# EasyEDA Pro project ProDoc_Avaota Pi A_2024-08-17.epro, schematic Avaota Pi A, sheets 6 to 13 of 13

## Sheets
6 PERF1: Board Name: Avaota Pi A; Create Date: 2024-02-07; Page Name: PERF1; Project Name: Avaota A1 八核 AIoT 开发板; Schematic Name: Avaota Pi A; Update Date: 2024-05-12
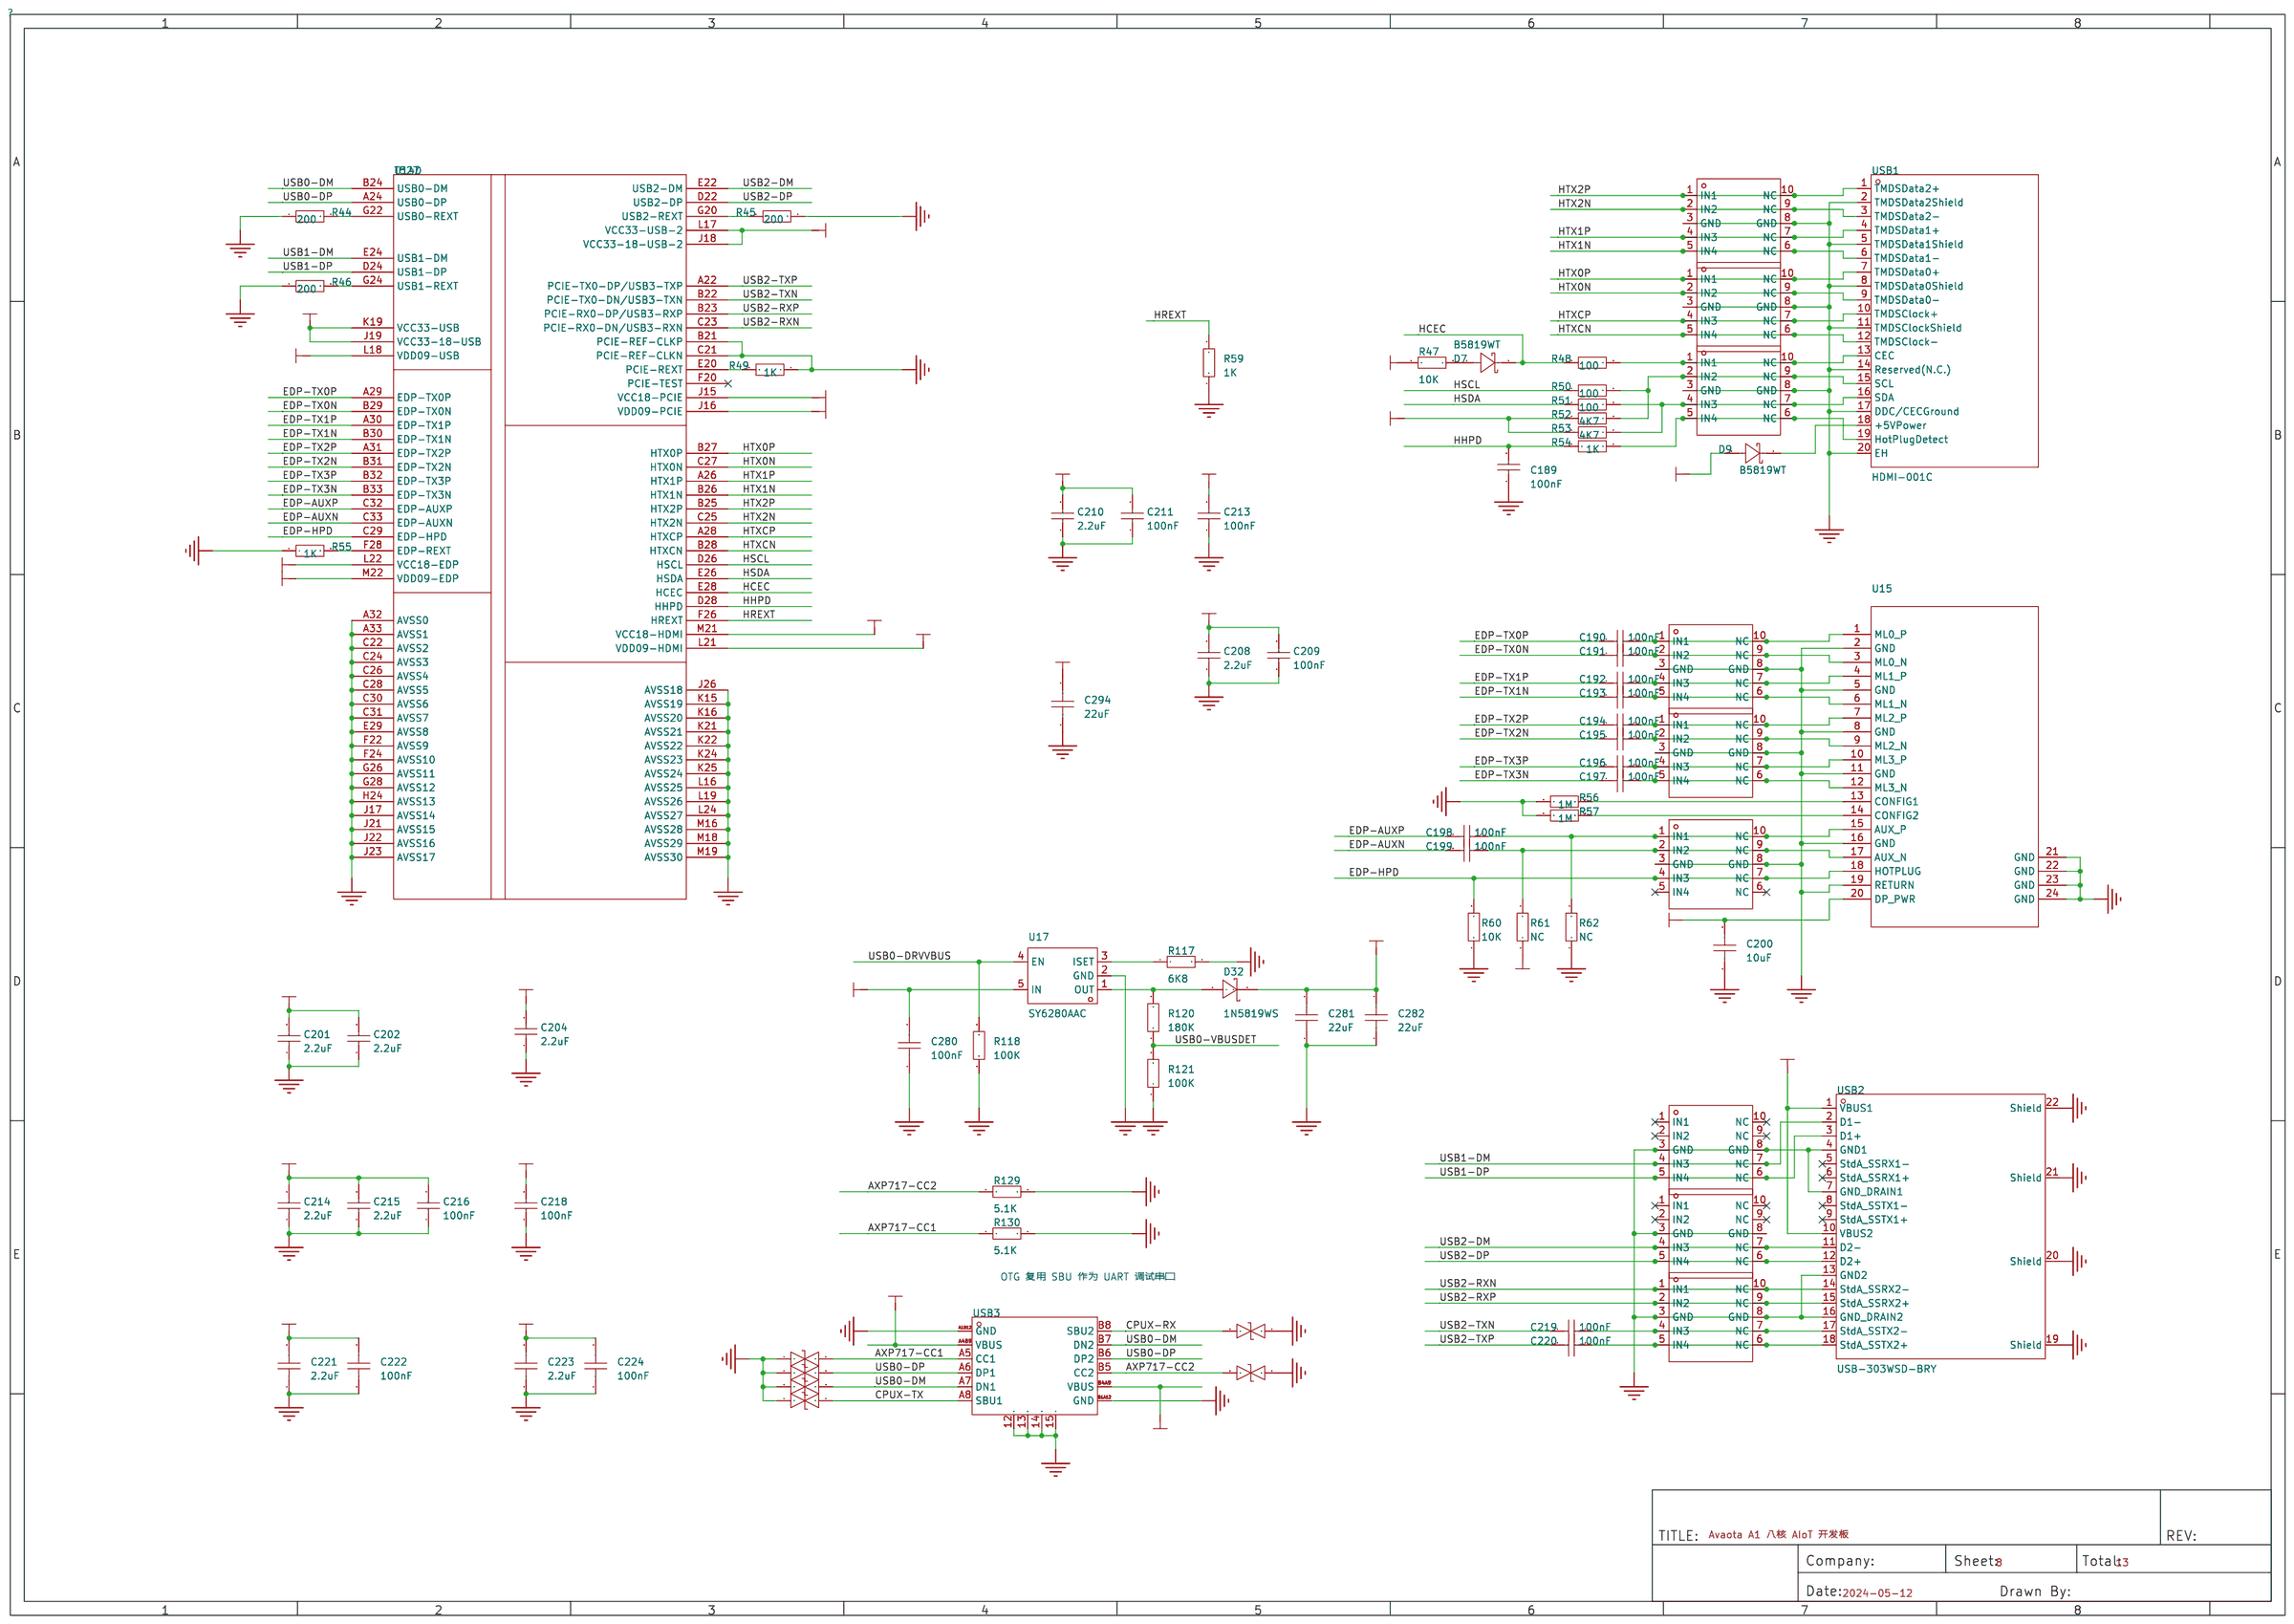
[diagram p5: PERF1]
7 BLOCK
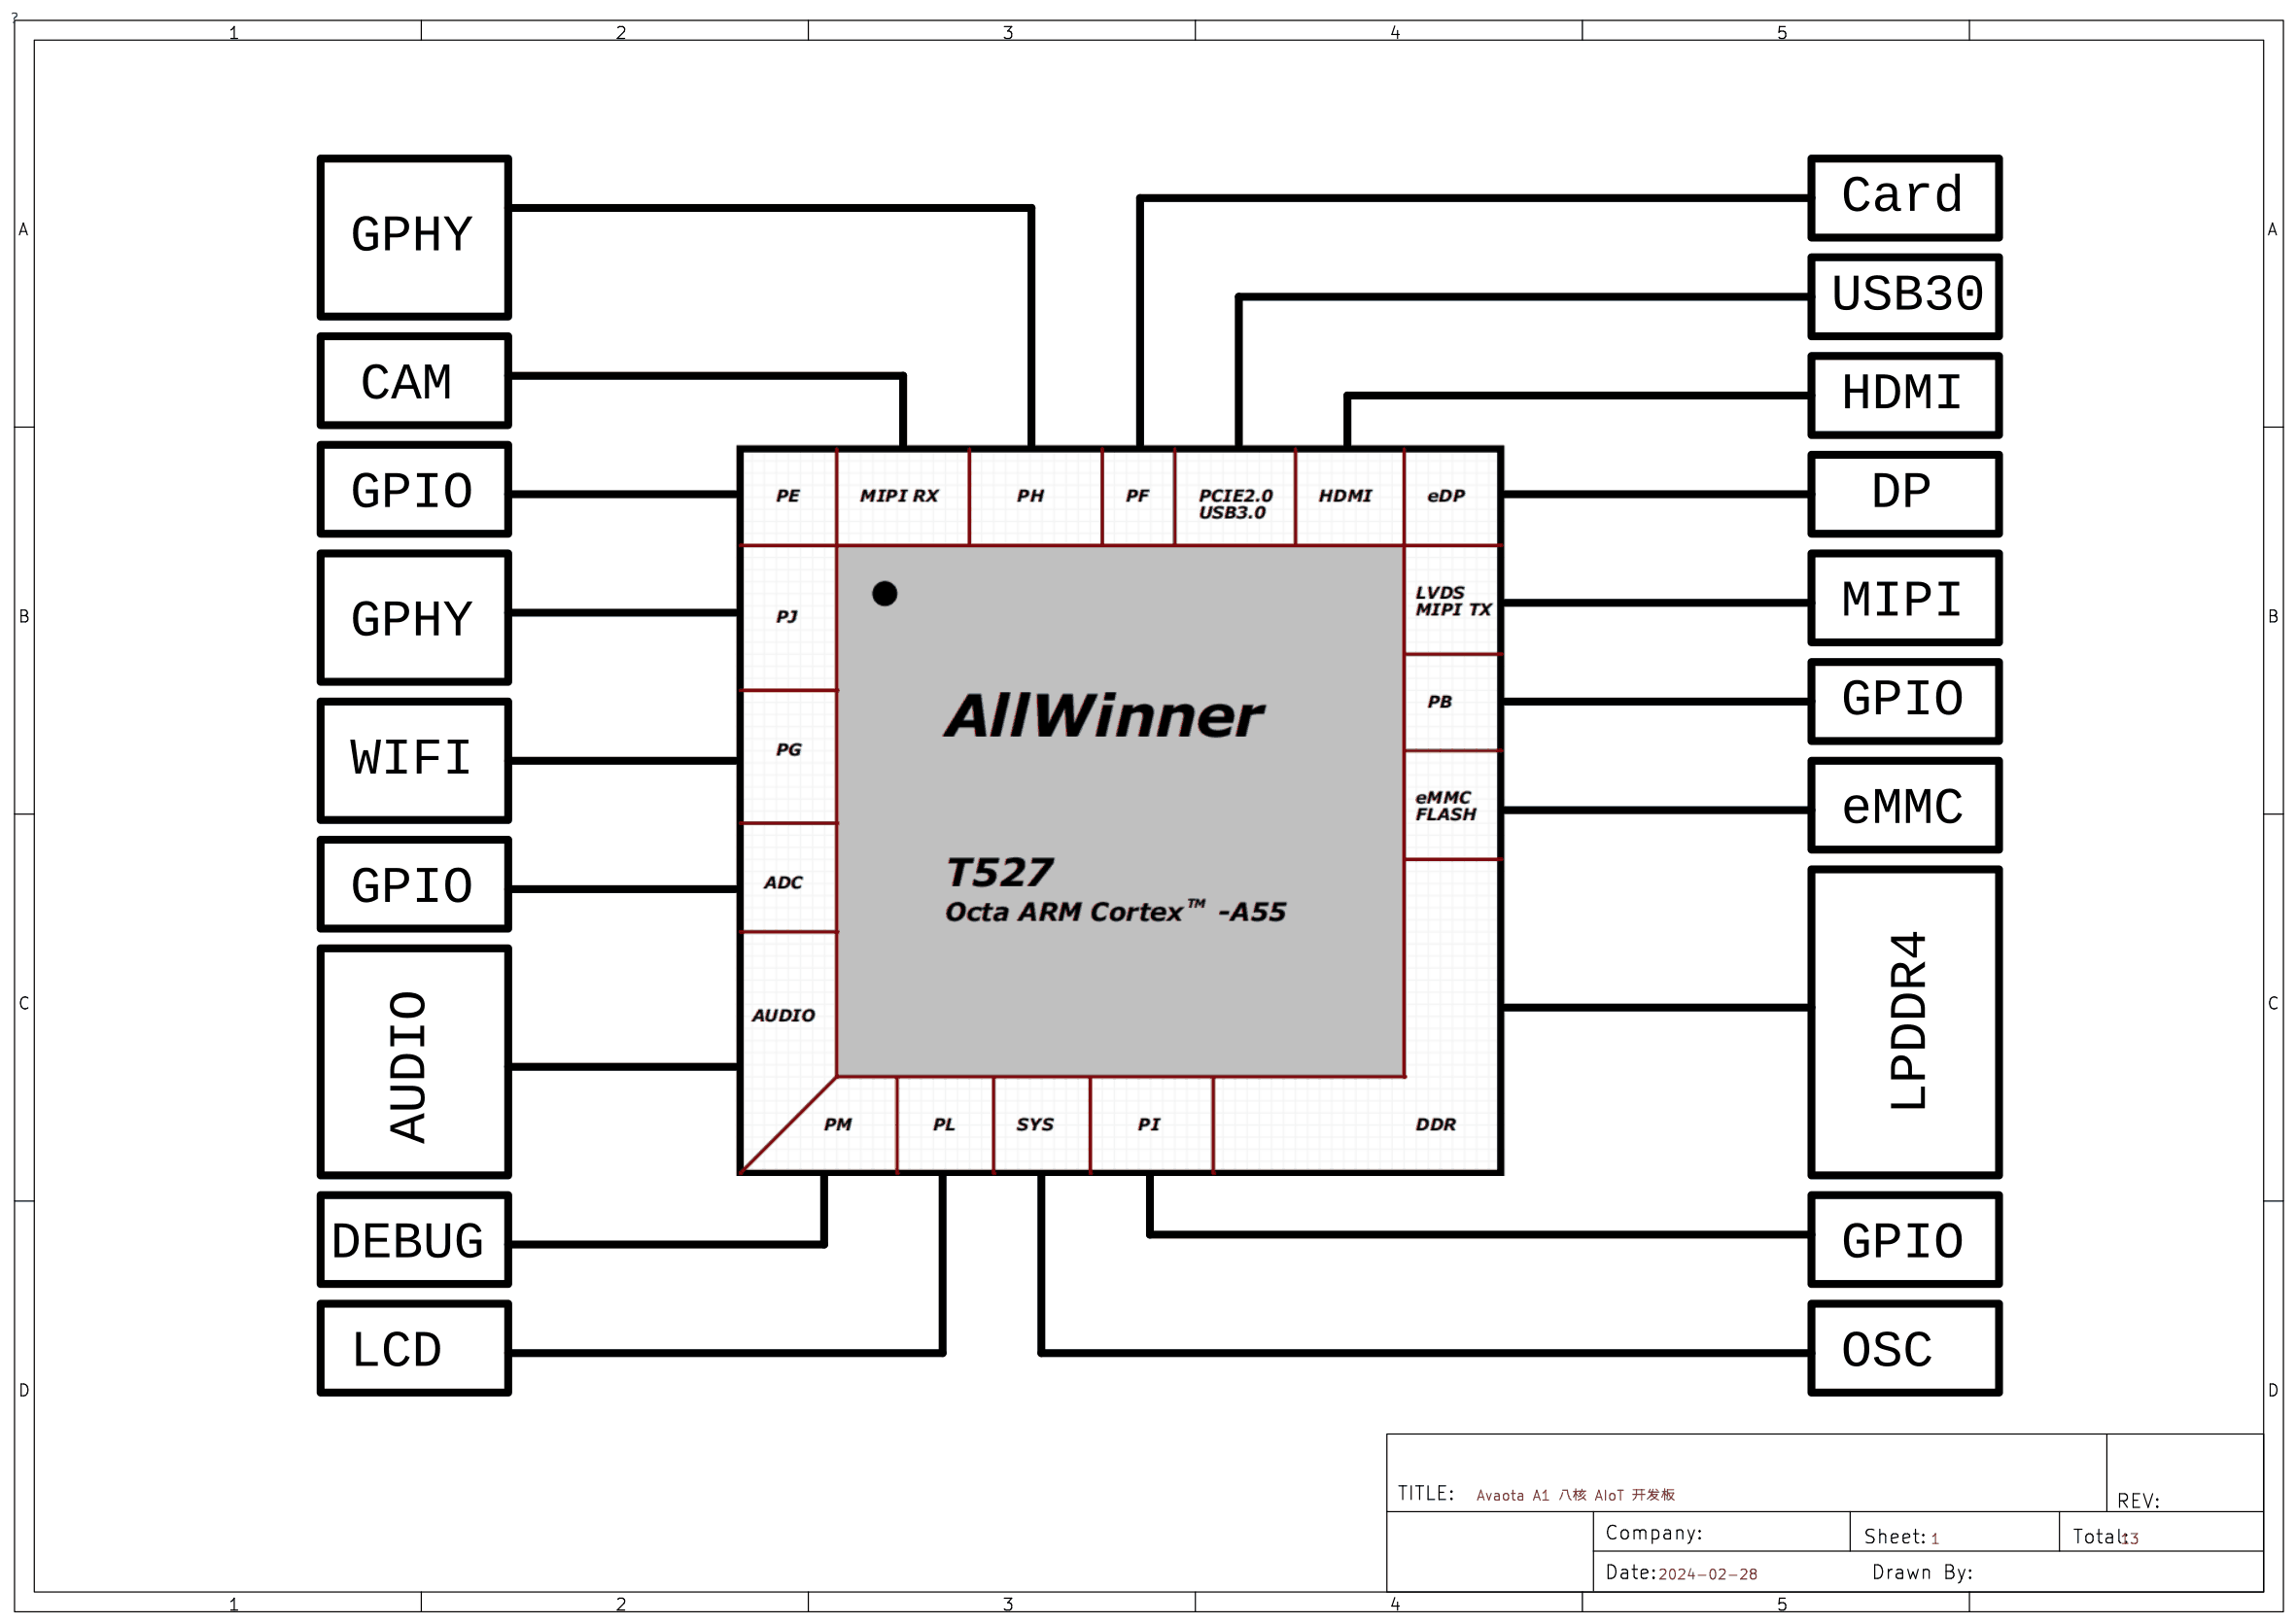
[diagram p6: BLOCK]
8 PERF2
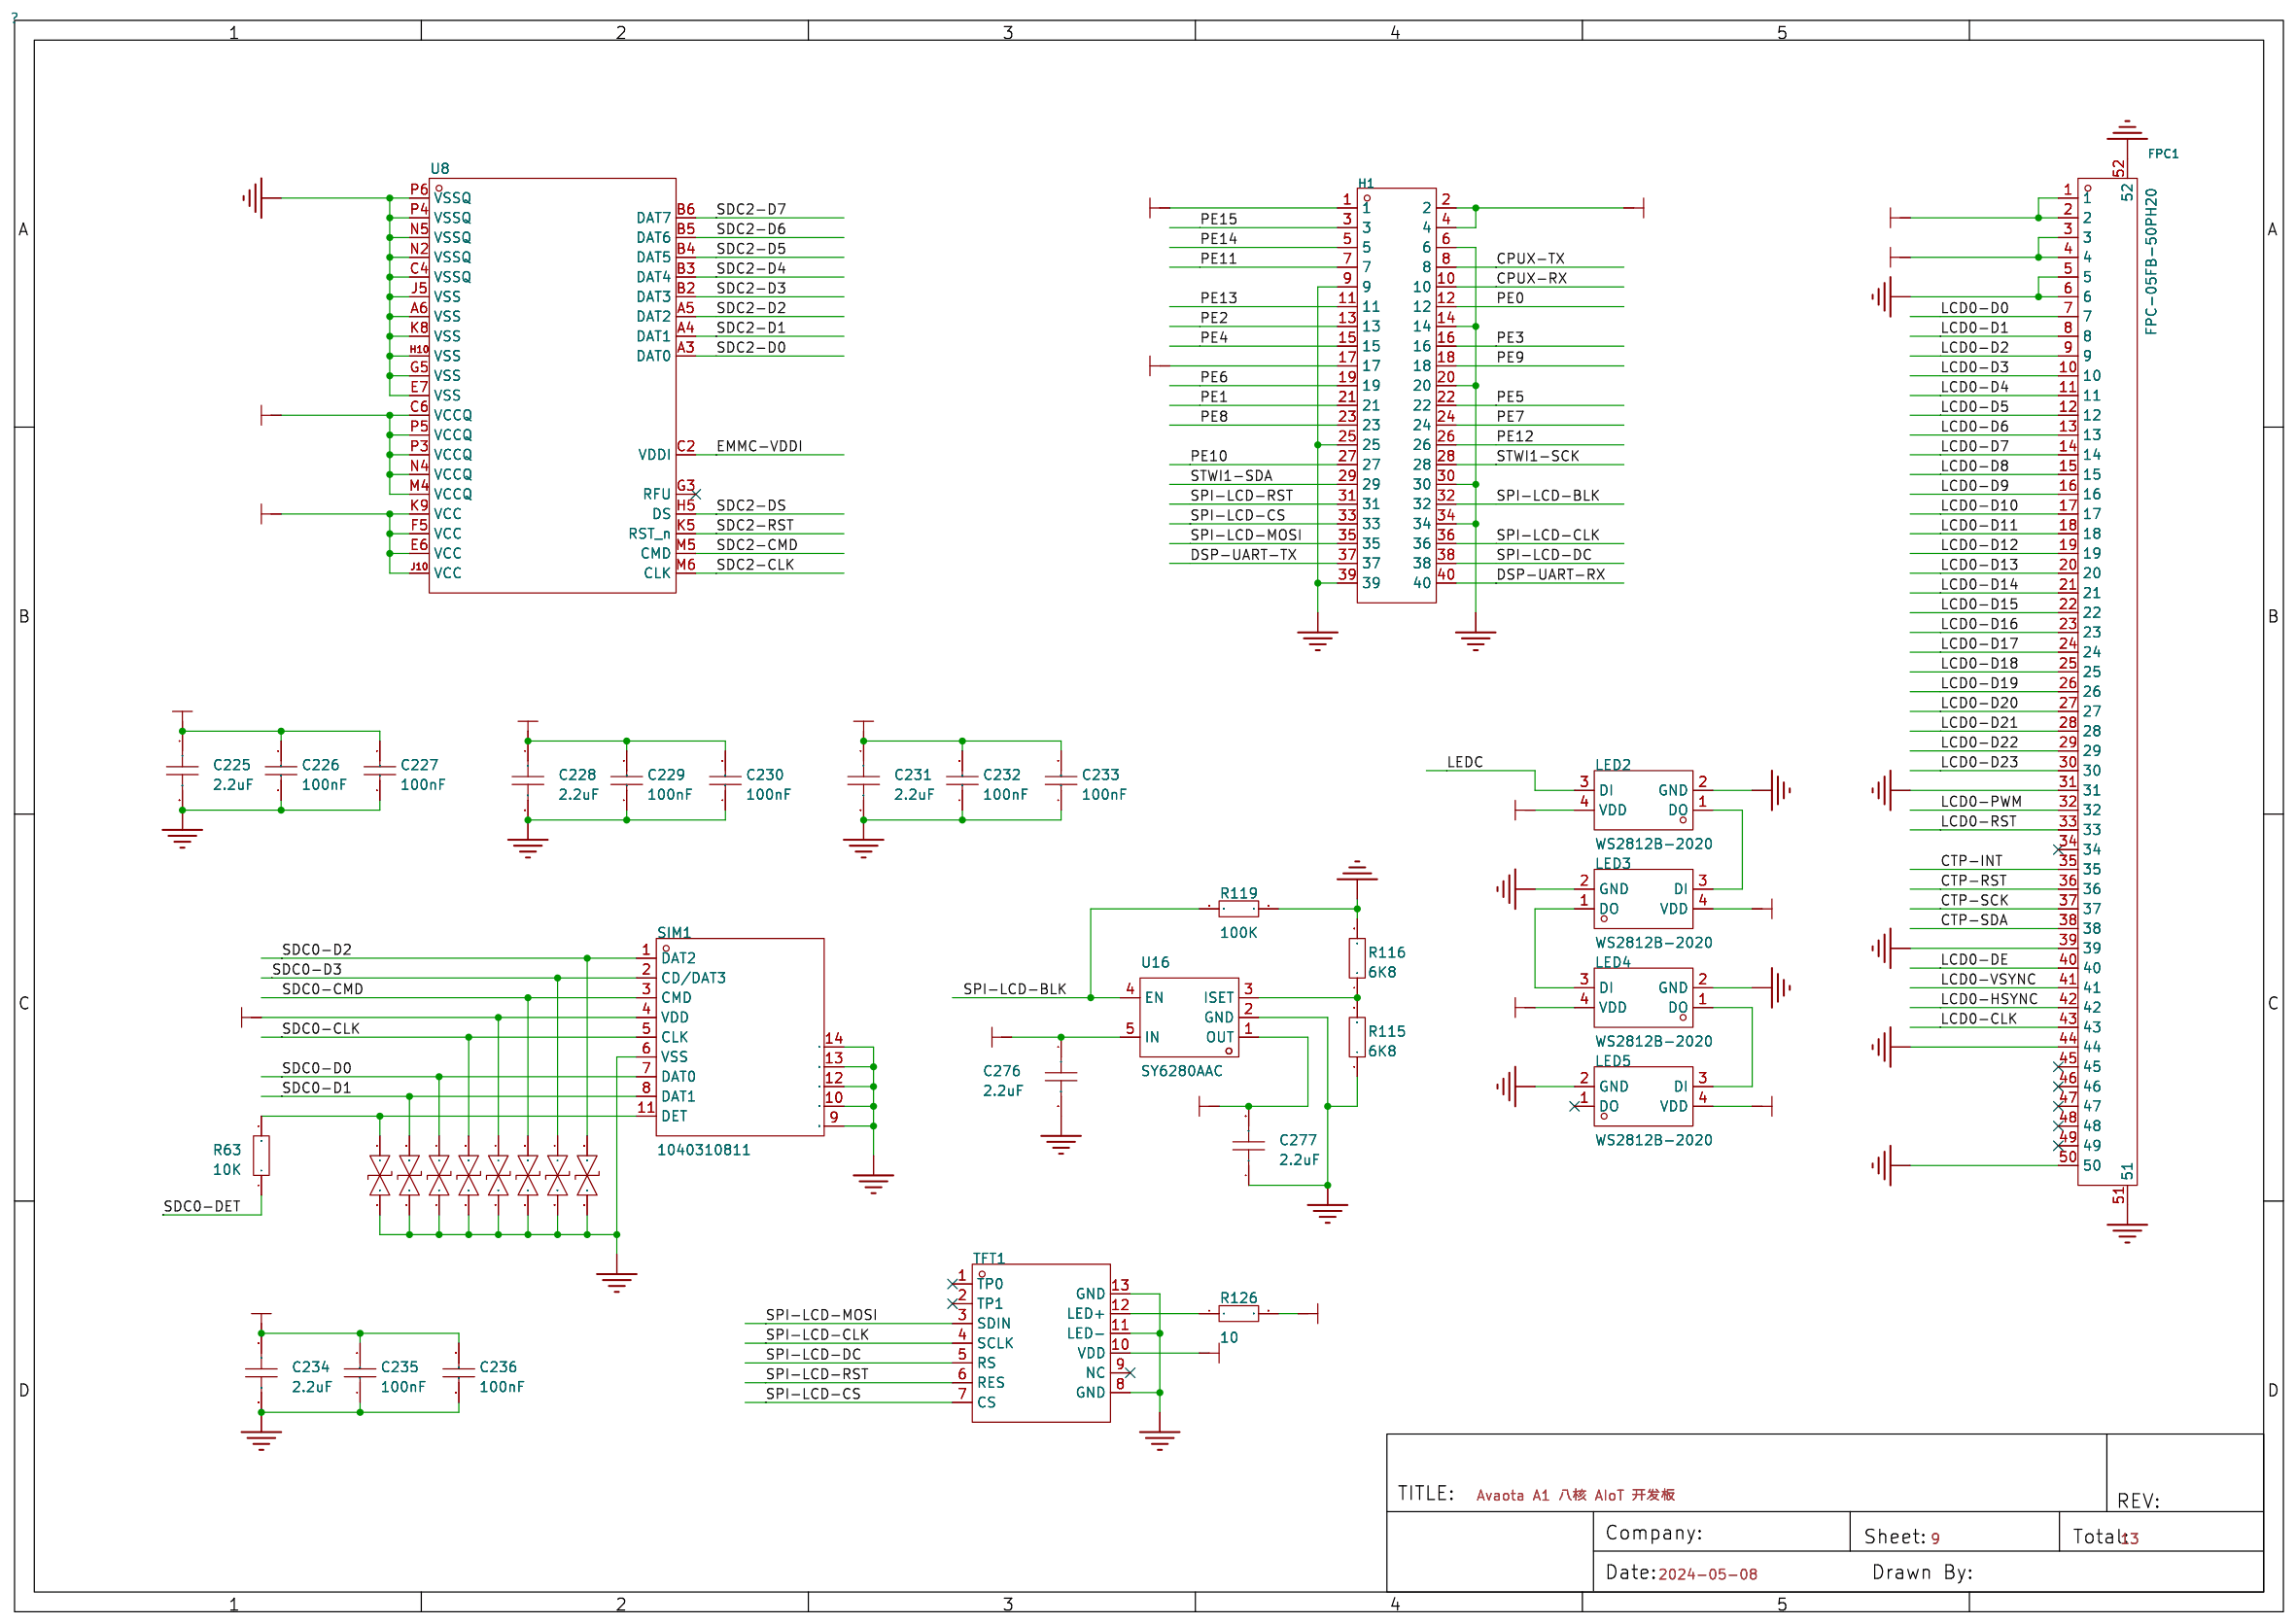
[diagram p7: PERF2]
9 GMAC0: Board Name: Avaota Pi A; Create Date: 2024-02-19; Page Name: GMAC0; Project Name: Avaota A1 八核 AIoT 开发板; Schematic Name: Avaota Pi A; Update Date: 2024-04-03
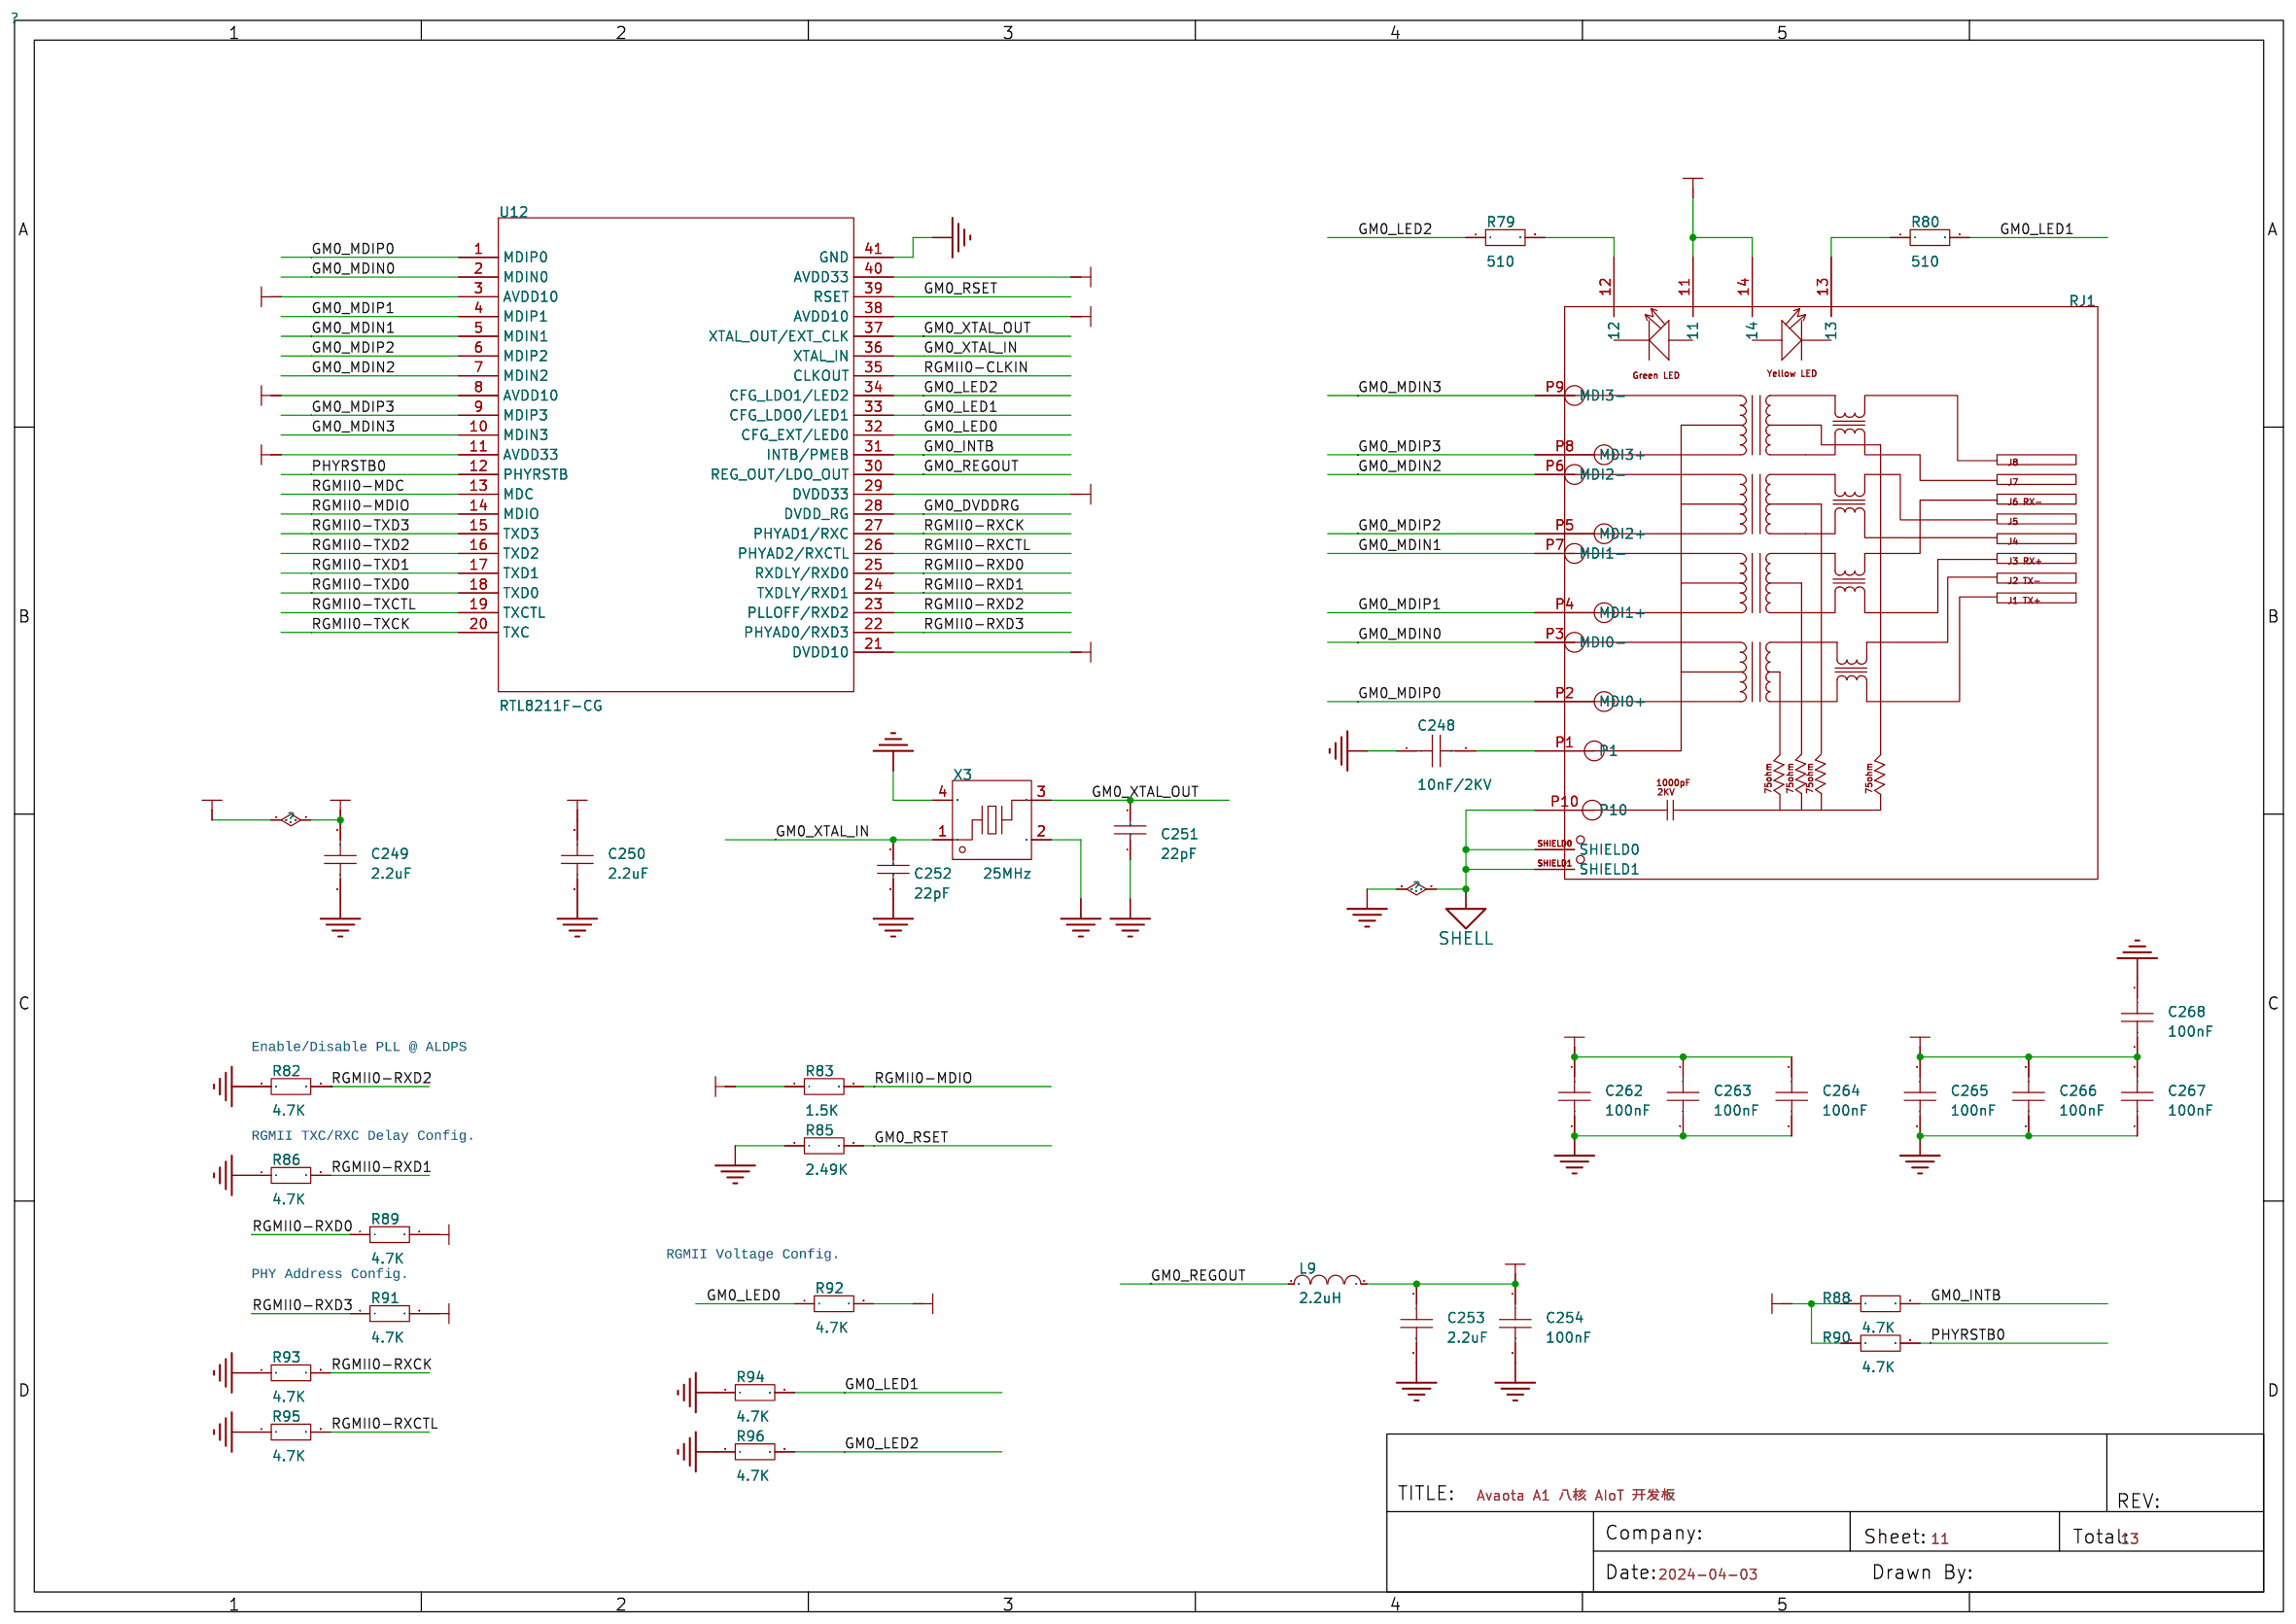
[diagram p8: GMAC0]
10 GMAC1
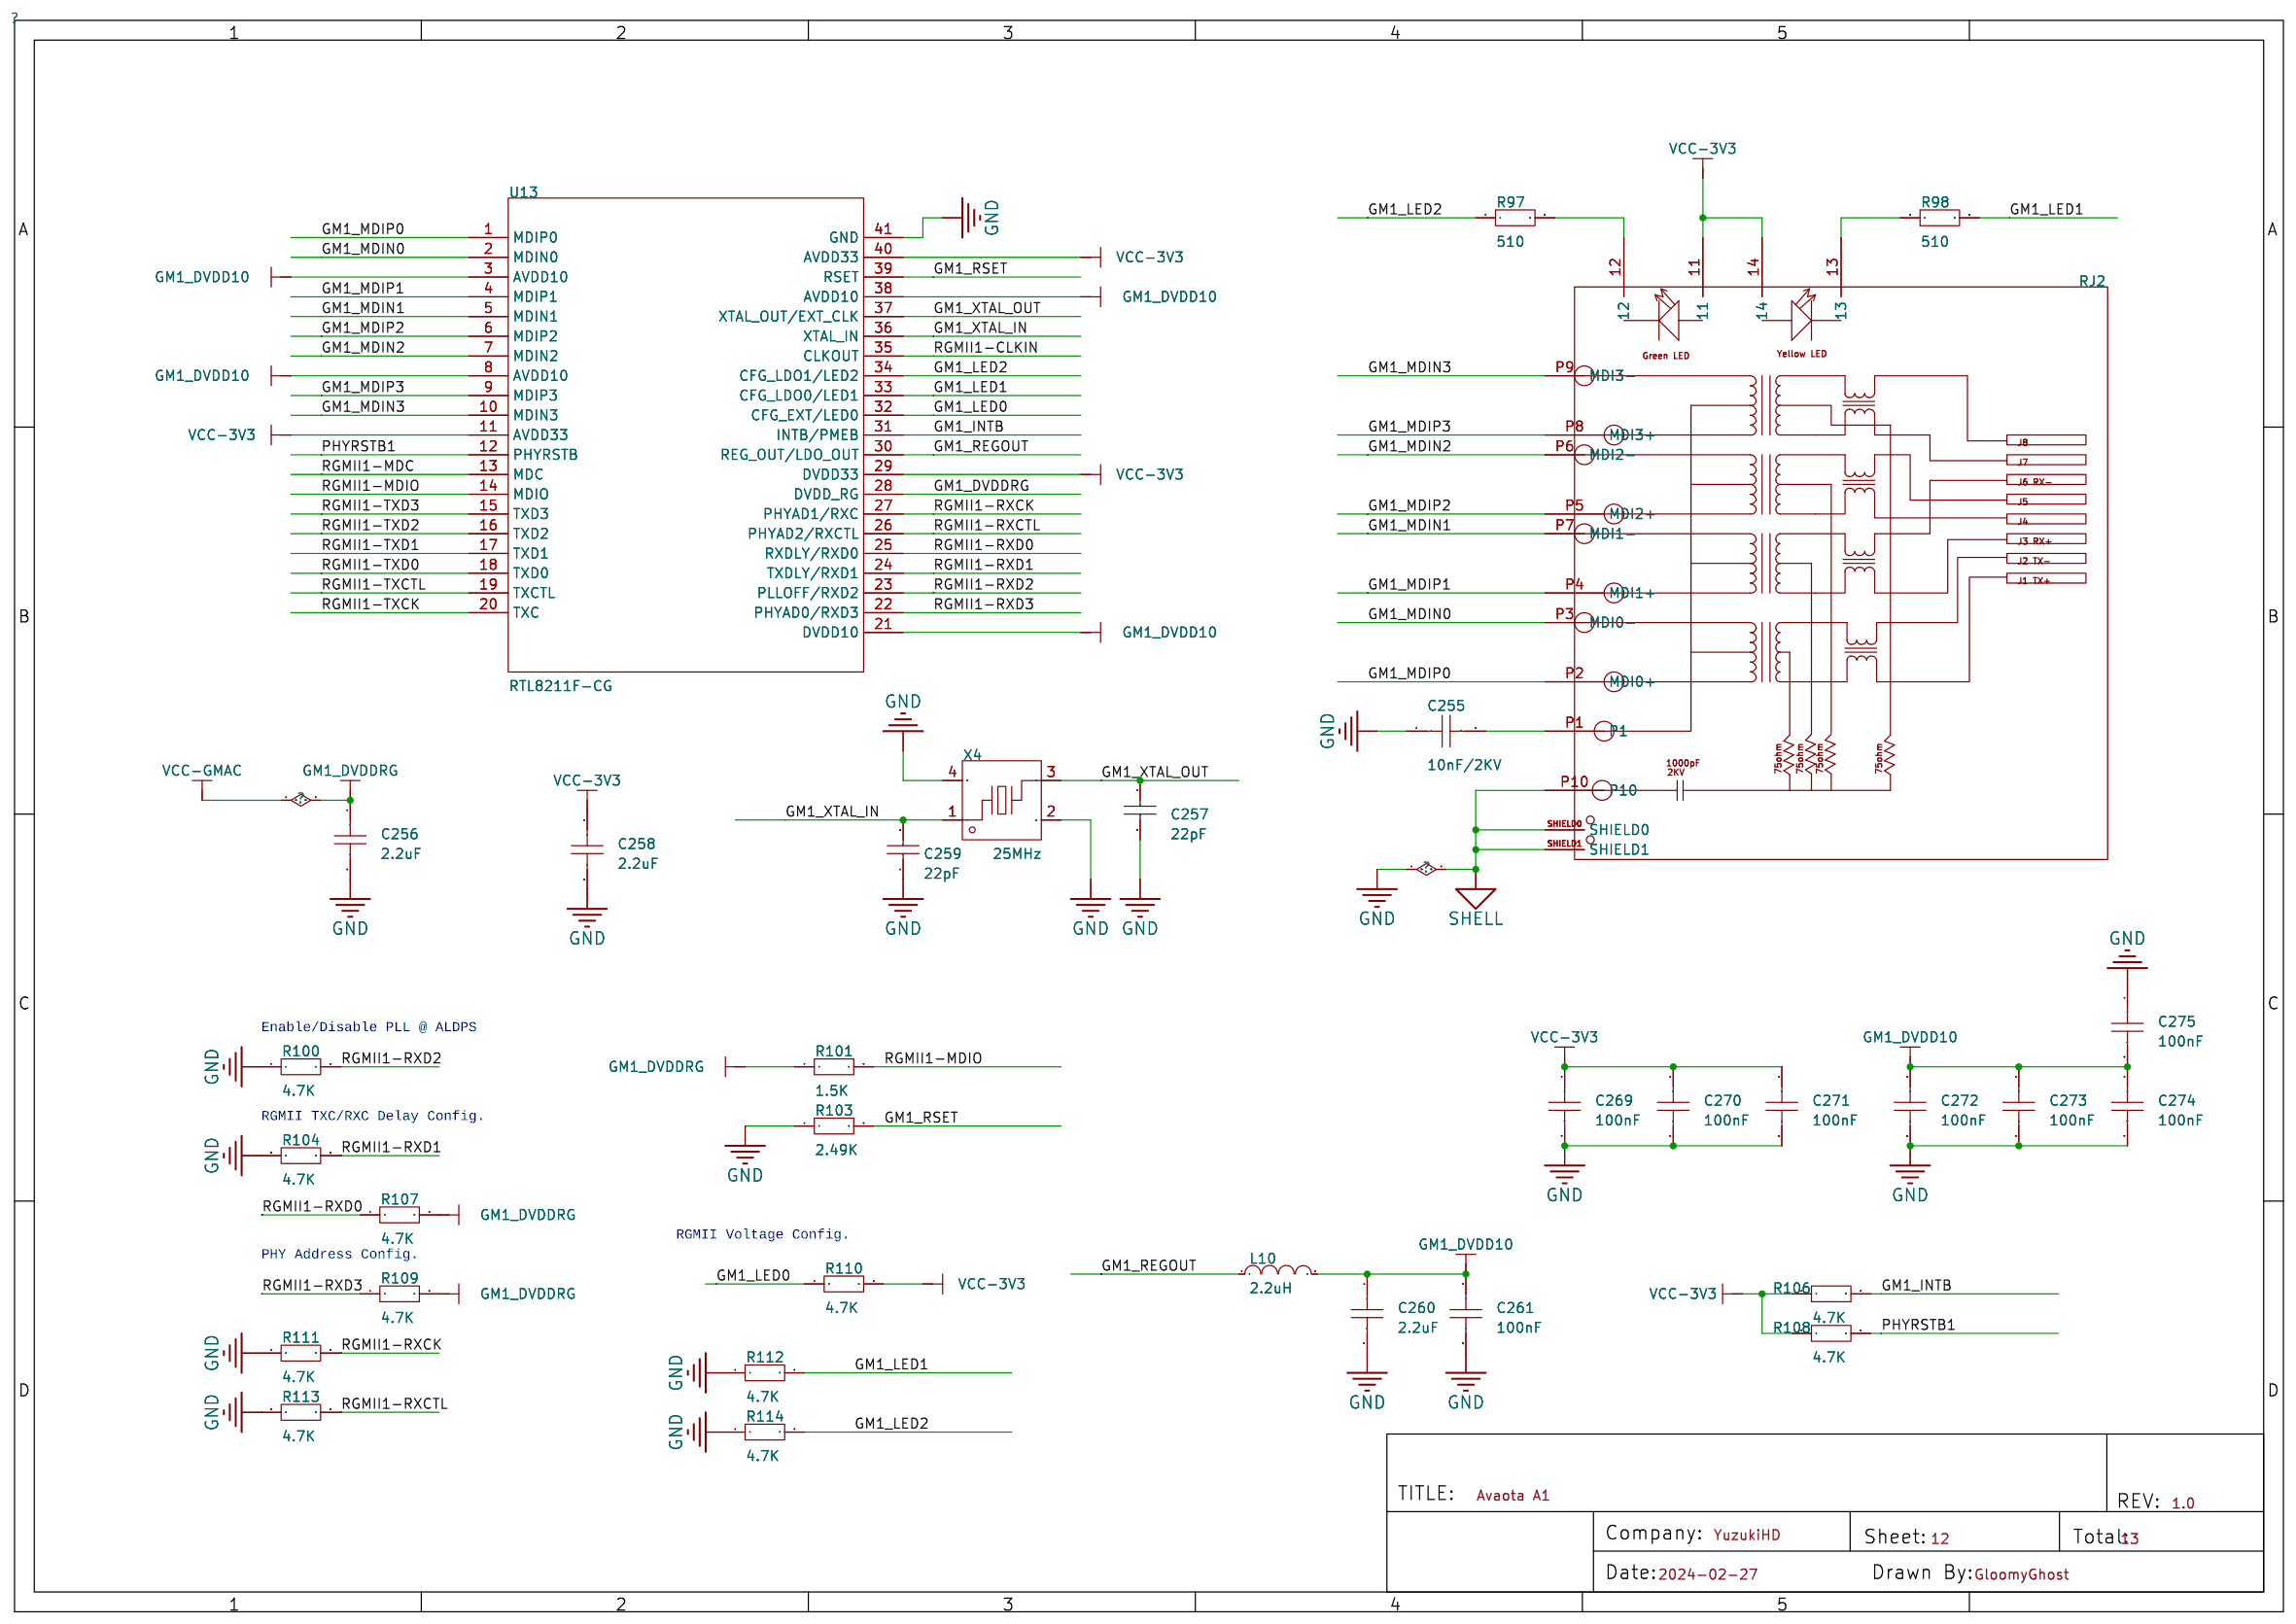
[diagram p9: GMAC1]
11 12VDC
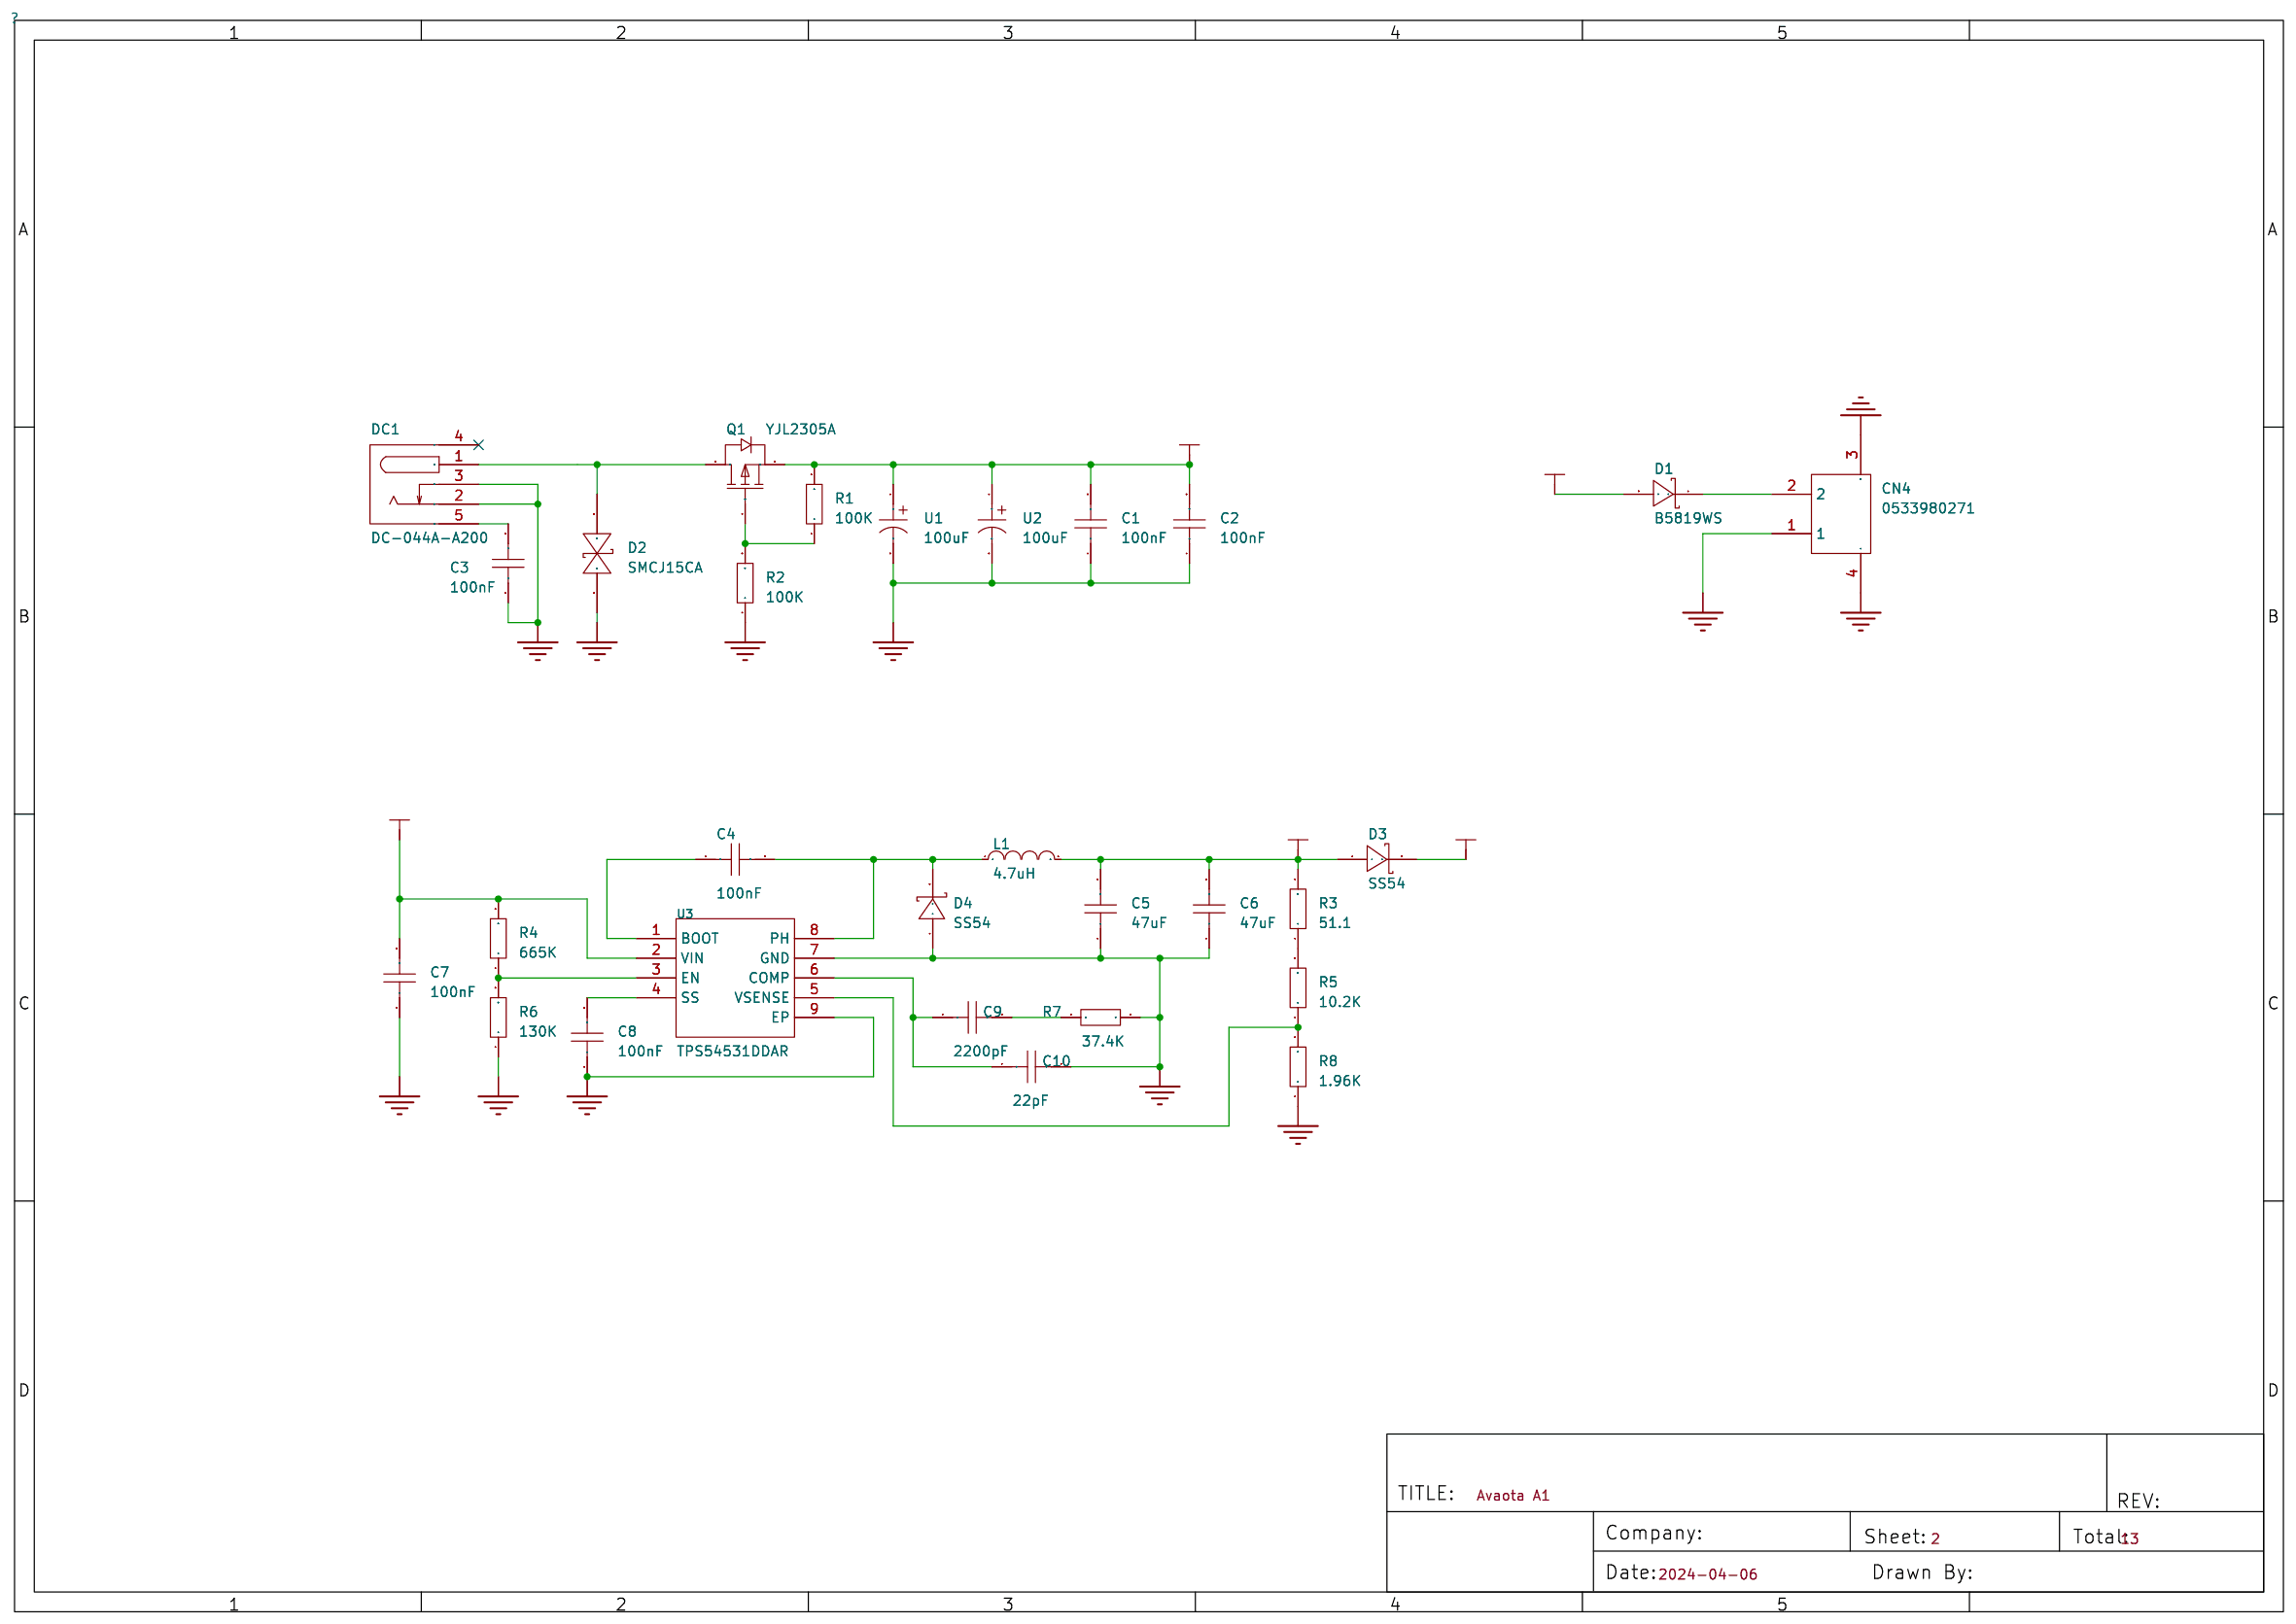
[diagram p10: 12VDC]
12 PERF3
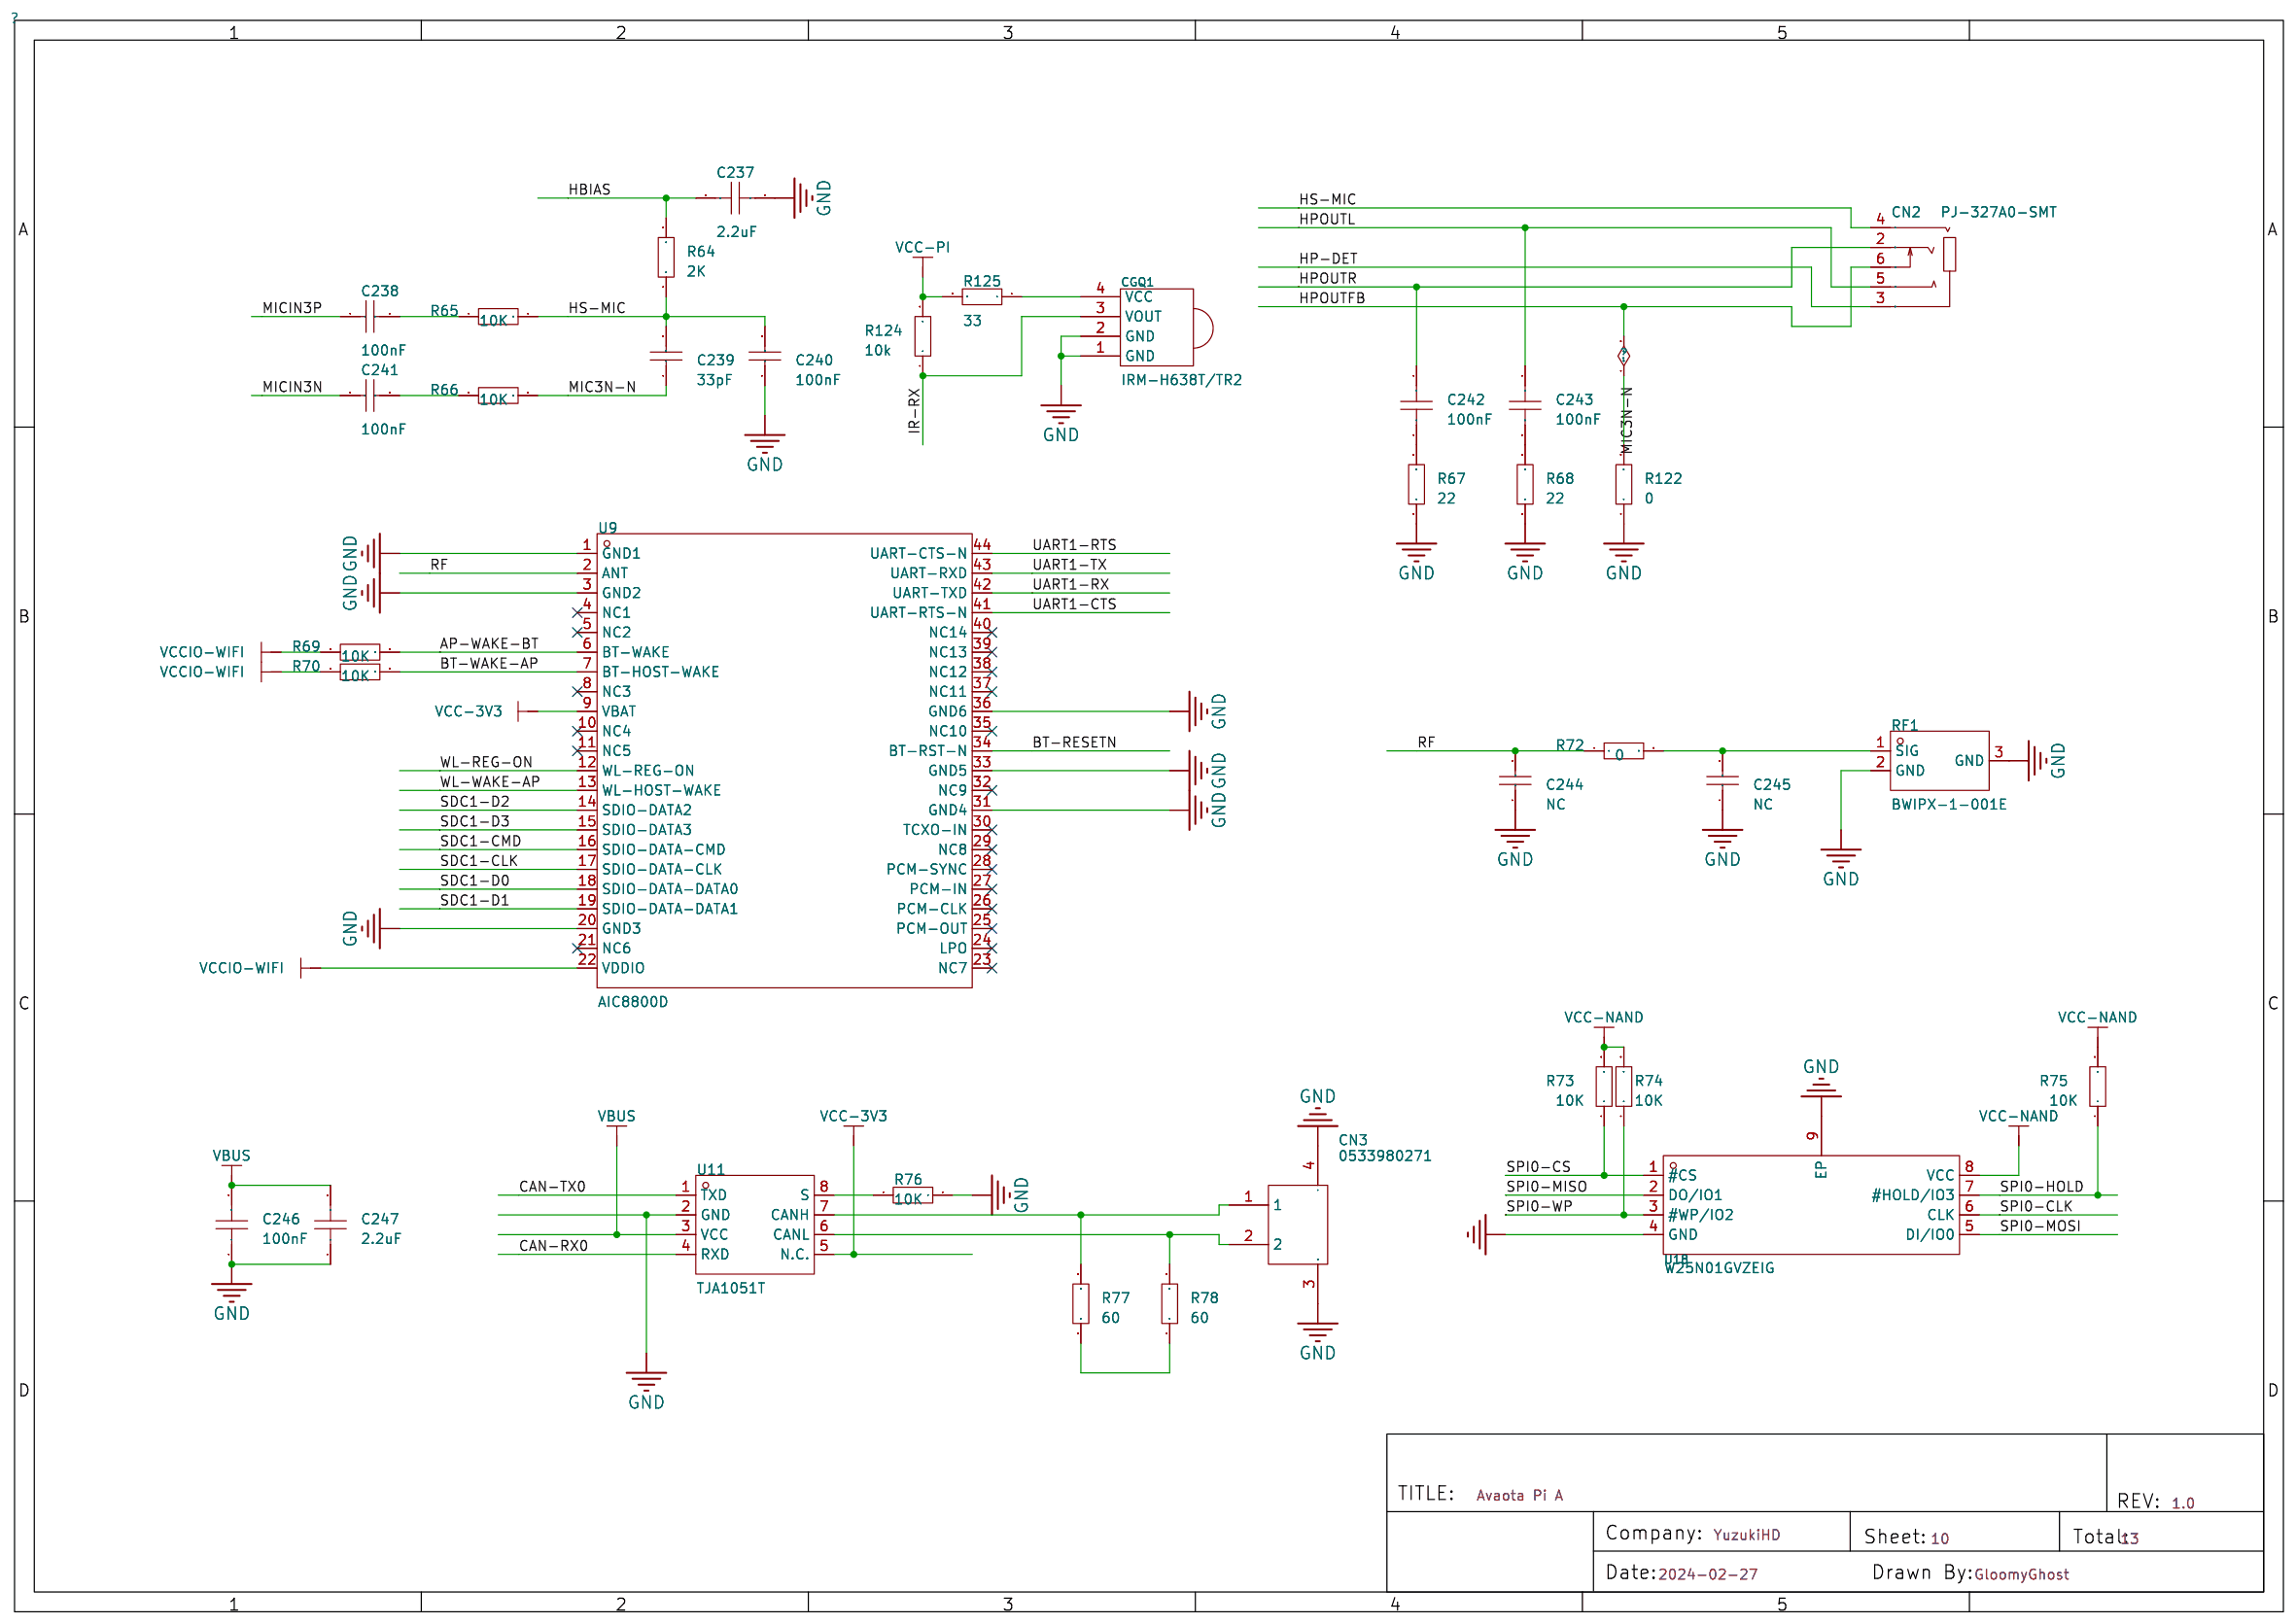
[diagram p11: PERF3]
13 CAMERA
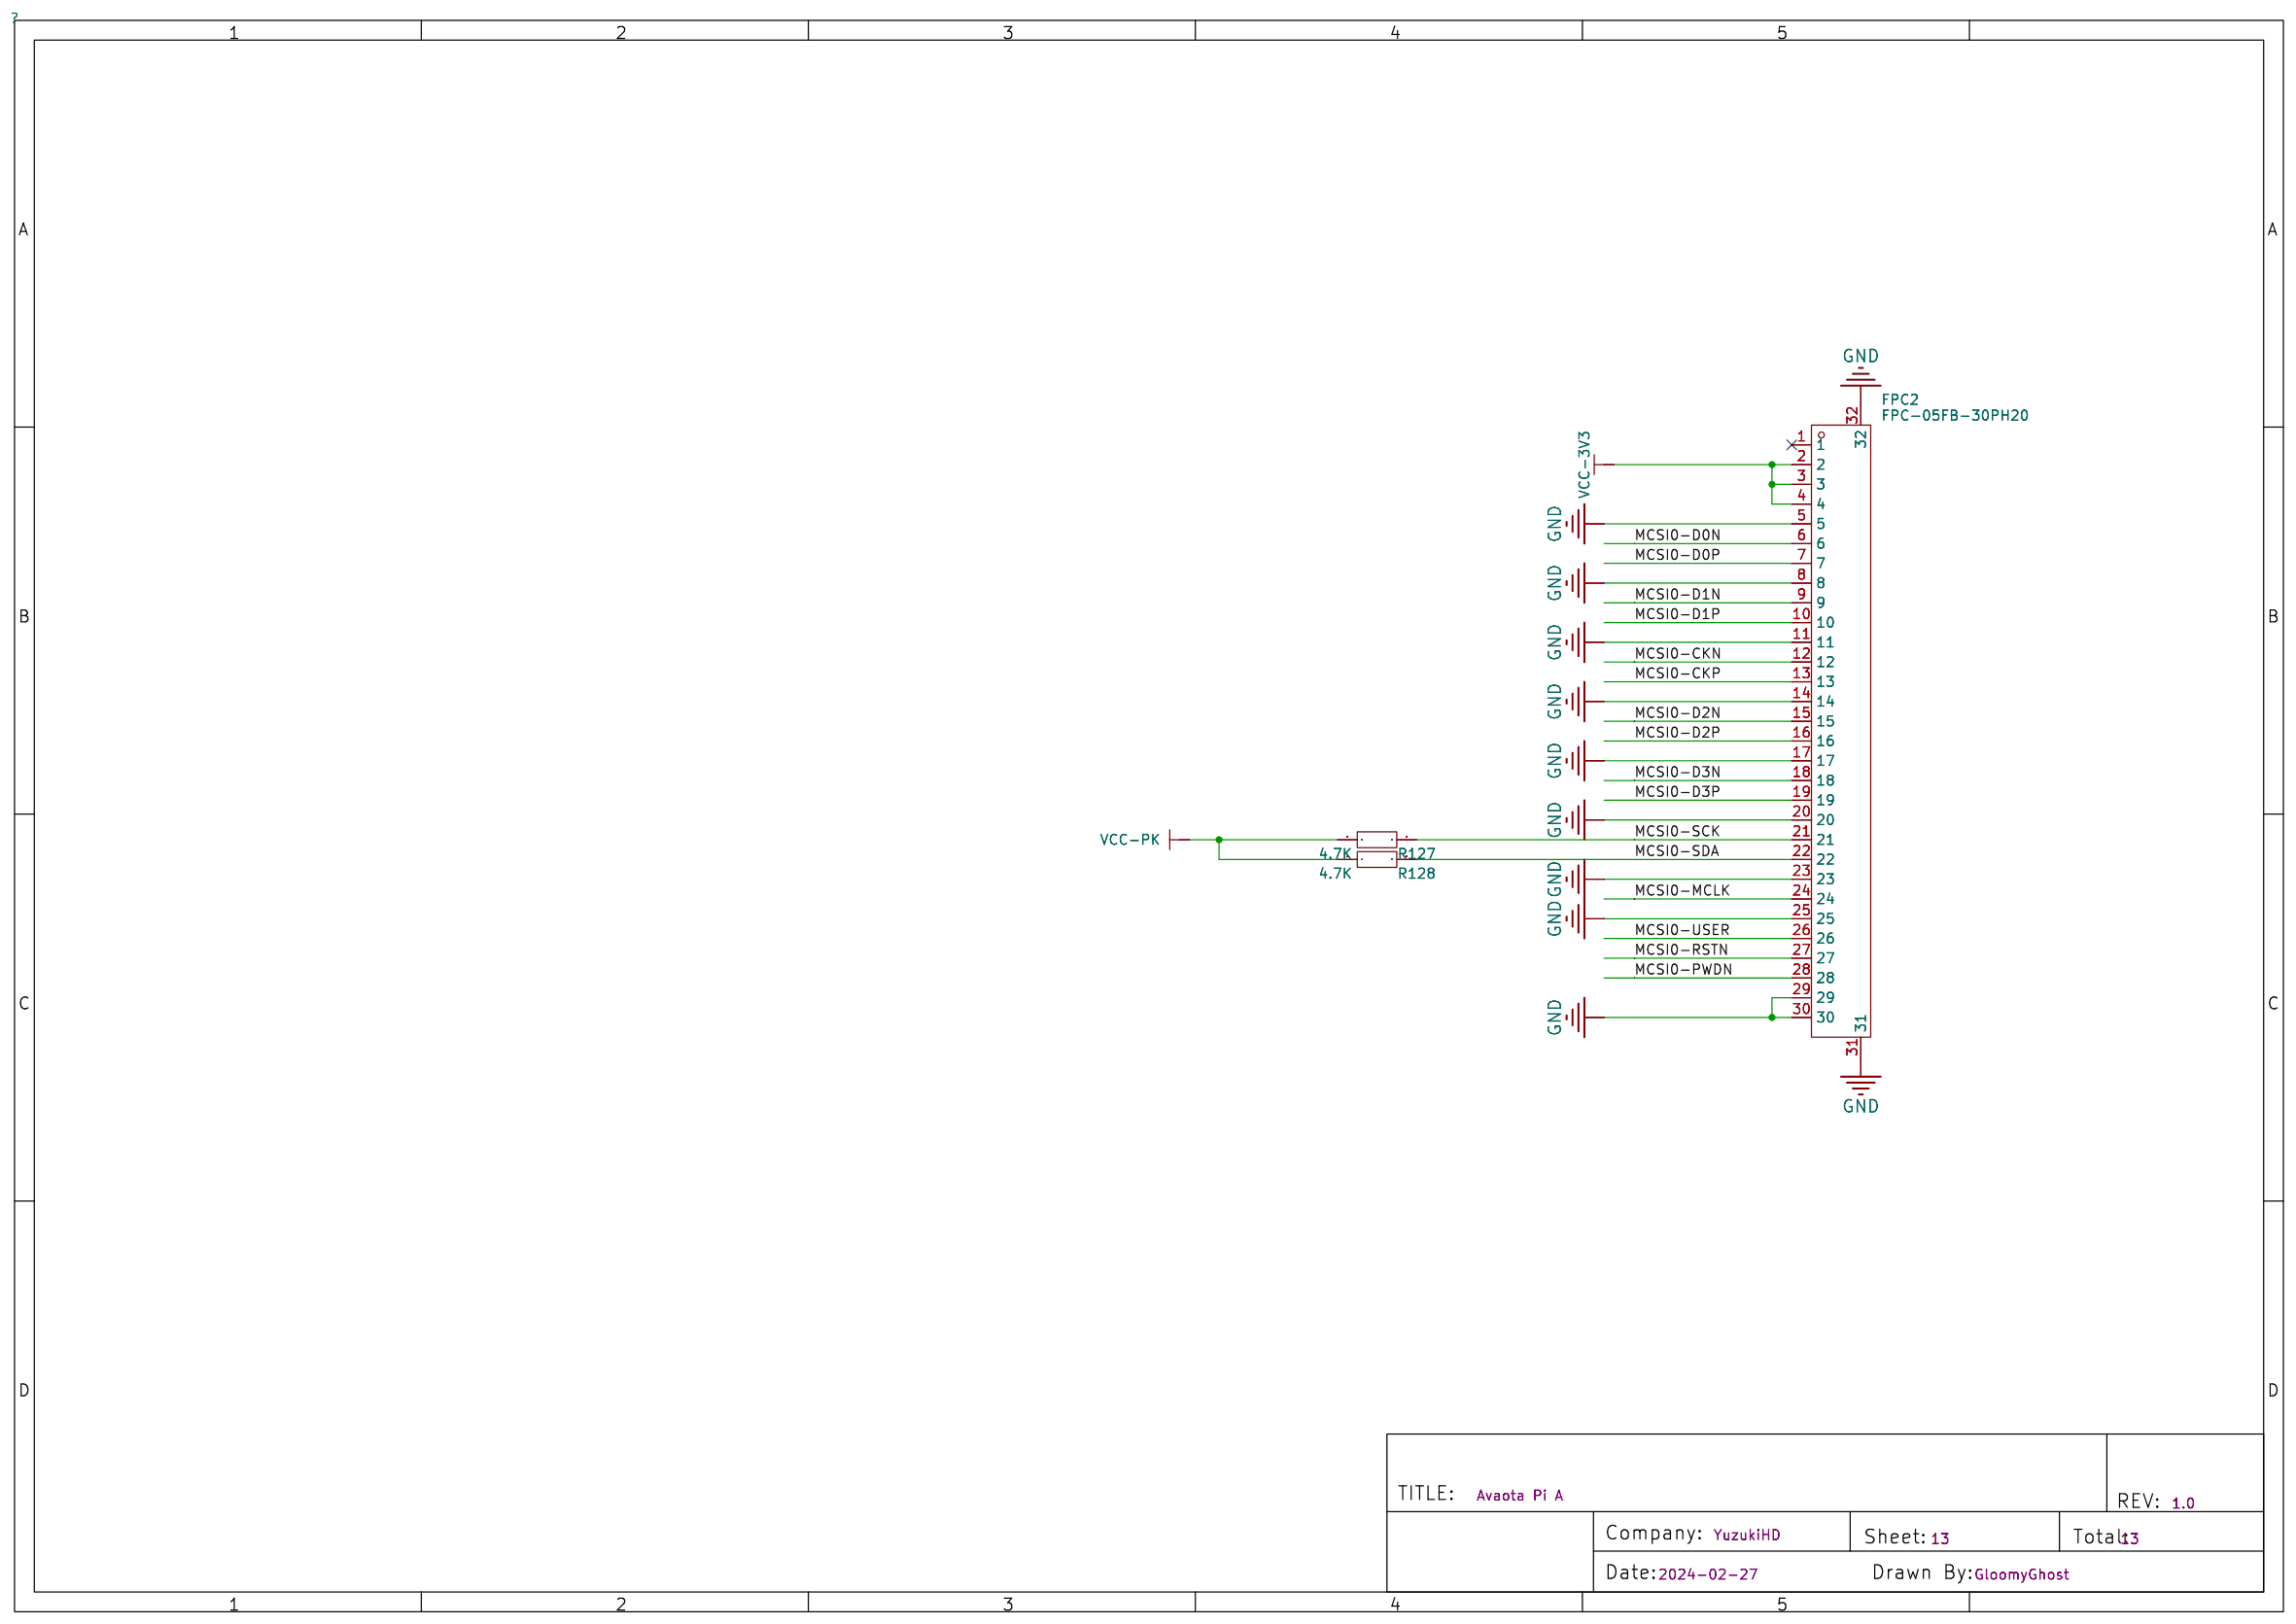
[diagram p12: CAMERA]

## Parts
sheet 12VDC
C1  100nF  [C0603-NSK]
C2  100nF  [C0603-NSK]
C3  100nF  [C0603-NSK]
C4  100nF  [c0402-nsk]
C5  47uF  [C0805 NSK]
C6  47uF  [C0805 NSK]
C7  100nF  [C0603-NSK]
C8  100nF  [C0603-NSK]
C9  2200pF  [c0402-nsk]
C10  22pF  [c0402-nsk]
CN4  0533980271  [CONN-SMD_2P-P1.25_053398-0X71]
D1  B5819WS  [SOD-323_L1.8-W1.3-LS2.5-RD]
D2  SMCJ15CA  [SMC_L6.9-W5.9-LS7.9-BI]
D3  SS54  [SMA_L4.4-W2.8-LS5.4-R-RD]
D4  SS54  [SMA_L4.4-W2.8-LS5.4-R-RD]
DC1  DC-044A-A200  [DC-IN-TH_DC-044A-20A]
L1  4.7uH  [IND-SMD_L7.0-W6.6]
Q1  YJL2305A  [SOT-23-3_L2.9-W1.3-P1.90-LS2.4-BR]
R1  100K  [R0603 NSK]
R2  100K  [R0603 NSK]
R3  51.1  [R0402-NSK]
R4  665K  [R0402-NSK]
R5  10.2K  [R0402-NSK]
R6  130K  [R0402-NSK]
R7  37.4K  [R0402-NSK]
R8  1.96K  [R0402-NSK]
U1  100uF  [CAP-SMD_BD6.3-L6.6-W6.6-LS7.6-RD]
U2  100uF  [CAP-SMD_BD6.3-L6.6-W6.6-LS7.6-RD]
U3  TPS54531DDAR  [SOIC-8_L5.0-W4.0-P1.27-LS6.0-BL-EP2.0]
sheet CAMERA
FPC2  FPC-05FB-30PH20  [FPC-SMD_30P-P0.50_FPC-05FB-30PH20]
R127  4.7K  [r0201 nsk]
R128  4.7K  [r0201 nsk]
sheet GMAC0
C248  10nF/2KV  [C1206]
C249  2.2uF  [c0201 nsk]
C250  2.2uF  [c0201 nsk]
C251  22pF  [c0201 nsk]
C252  22pF  [c0201 nsk]
C253  2.2uF  [c0201 nsk]
C254  100nF  [c0201 nsk]
C262  100nF  [c0201 nsk]
C263  100nF  [c0201 nsk]
C264  100nF  [c0201 nsk]
C265  100nF  [c0201 nsk]
C266  100nF  [c0201 nsk]
C267  100nF  [c0201 nsk]
C268  100nF  [c0201 nsk]
L9  2.2uH  [IND-SMD_L2.0-W1.6]
R79  510  [r0201 nsk]
R80  510  [r0201 nsk]
R82  4.7K  [r0201 nsk]
R83  1.5K  [r0201 nsk]
R85  2.49K  [r0201 nsk]
R86  4.7K  [r0201 nsk]
R88  4.7K  [r0201 nsk]
R89  4.7K  [r0201 nsk]
R90  4.7K  [r0201 nsk]
R91  4.7K  [r0201 nsk]
R92  4.7K  [r0201 nsk]
R93  4.7K  [r0201 nsk]
R94  4.7K  [r0201 nsk]
R95  4.7K  [r0201 nsk]
R96  4.7K  [r0201 nsk]
RJ1  -  [RJ45-TH_HR911130A]
U12  RTL8211F-CG  [WQFN-40_L5.0-W5.0-P0.4-BL-EP]
X3  25MHz  [crystal-smd_4p-l2.0-w1.6-bl-nsk]
sheet GMAC1
C255  10nF/2KV  [C1206]
C256  2.2uF  [c0201 nsk]
C257  22pF  [c0201 nsk]
C258  2.2uF  [c0201 nsk]
C259  22pF  [c0201 nsk]
C260  2.2uF  [c0201 nsk]
C261  100nF  [c0201 nsk]
C269  100nF  [c0201 nsk]
C270  100nF  [c0201 nsk]
C271  100nF  [c0201 nsk]
C272  100nF  [c0201 nsk]
C273  100nF  [c0201 nsk]
C274  100nF  [c0201 nsk]
C275  100nF  [c0201 nsk]
L10  2.2uH  [IND-SMD_L2.0-W1.6]
R97  510  [r0201 nsk]
R98  510  [r0201 nsk]
R100  4.7K  [r0201 nsk]
R101  1.5K  [r0201 nsk]
R103  2.49K  [r0201 nsk]
R104  4.7K  [r0201 nsk]
R106  4.7K  [r0201 nsk]
R107  4.7K  [r0201 nsk]
R108  4.7K  [r0201 nsk]
R109  4.7K  [r0201 nsk]
R110  4.7K  [r0201 nsk]
R111  4.7K  [r0201 nsk]
R112  4.7K  [r0201 nsk]
R113  4.7K  [r0201 nsk]
R114  4.7K  [r0201 nsk]
RJ2  -  [RJ45-TH_HR911130A]
U13  RTL8211F-CG  [WQFN-40_L5.0-W5.0-P0.4-BL-EP]
X4  25MHz  [crystal-smd_4p-l2.0-w1.6-bl-nsk]
sheet PERF1
C189  100nF  [c0201 nsk]
C190  100nF  [c0201 nsk]
C191  100nF  [c0201 nsk]
C192  100nF  [c0201 nsk]
C193  100nF  [c0201 nsk]
C194  100nF  [c0201 nsk]
C195  100nF  [c0201 nsk]
C196  100nF  [c0201 nsk]
C197  100nF  [c0201 nsk]
C198  100nF  [c0201 nsk]
C199  100nF  [c0201 nsk]
C200  10uF  [c0402-nsk]
C201  2.2uF  [c0201 nsk]
C202  2.2uF  [c0201 nsk]
C204  2.2uF  [c0201 nsk]
C208  2.2uF  [c0201 nsk]
C209  100nF  [c0201 nsk]
C210  2.2uF  [c0201 nsk]
C211  100nF  [c0201 nsk]
C213  100nF  [c0201 nsk]
C214  2.2uF  [c0201 nsk]
C215  2.2uF  [c0201 nsk]
C216  100nF  [c0201 nsk]
C218  100nF  [c0201 nsk]
C219  100nF  [c0201 nsk]
C220  100nF  [c0201 nsk]
C221  2.2uF  [c0402-nsk]
C222  100nF  [c0402-nsk]
C223  2.2uF  [c0402-nsk]
C224  100nF  [c0402-nsk]
C280  100nF  [c0402-nsk]
C281  22uF  [C0603-NSK]
C282  22uF  [C0603-NSK]
C294  22uF  [C1206]
D5  RClamp0524PATCT  [SLP2510P8_L2.5-W1.0-P0.50-BL]
D6  RClamp0524PATCT  [SLP2510P8_L2.5-W1.0-P0.50-BL]
D7  B5819WT  [SOD-523_L1.2-W0.8-LS1.6-RD-1 NSK]
D8  RClamp0524PATCT  [SLP2510P8_L2.5-W1.0-P0.50-BL]
D9  B5819WT  [SOD-523_L1.2-W0.8-LS1.6-RD-1 NSK]
D10  RClamp0524PATCT  [SLP2510P8_L2.5-W1.0-P0.50-BL]
D11  RClamp0524PATCT  [SLP2510P8_L2.5-W1.0-P0.50-BL]
D12  RClamp0524PATCT  [SLP2510P8_L2.5-W1.0-P0.50-BL]
D13  RClamp0524PATCT  [SLP2510P8_L2.5-W1.0-P0.50-BL]
D14  RClamp0524PATCT  [SLP2510P8_L2.5-W1.0-P0.50-BL]
D15  RClamp0524PATCT  [SLP2510P8_L2.5-W1.0-P0.50-BL]
D24  0402ESDA-05N  [d0402]
D25  0402ESDA-05N  [d0402]
D26  0402ESDA-05N  [d0402]
D27  0402ESDA-05N  [d0402]
D30  0402ESDA-05N  [d0402]
D31  0402ESDA-05N  [d0402]
D32  1N5819WS  [SOD-323_L1.8-W1.3-LS2.5-RD]
R44  200  [r0201 nsk]
R45  200  [r0201 nsk]
R46  200  [r0201 nsk]
R47  10K  [r0201 nsk]
R48  100  [r0201 nsk]
R49  1K  [r0201 nsk]
R50  100  [r0201 nsk]
R51  100  [r0201 nsk]
R52  4K7  [r0201 nsk]
R53  4K7  [r0201 nsk]
R54  1K  [r0201 nsk]
R55  1K  [r0201 nsk]
R56  1M  [r0201 nsk]
R57  1M  [r0201 nsk]
R59  1K  [r0201 nsk]
R60  10K  [r0201 nsk]
R61  NC  [r0201 nsk]
R62  NC  [r0201 nsk]
R117  6K8  [r0201 nsk]
R118  100K  [r0201 nsk]
R120  180K  [r0201 nsk]
R121  100K  [r0201 nsk]
R129  5.1K  [r0201 nsk]
R130  5.1K  [r0201 nsk]
U15  -  [DP_TH_SIDE_VERTICAL]
U17  SY6280AAC  [SOT-23-5_L3.0-W1.7-P0.95-LS2.8-BL]
USB1  HDMI-001C  [HDMI-SMD_HDMI-001C]
USB2  USB-303WSD-BRY  [USB-A-TH_XUNPU_USB-303WSD-BRY]
USB3  -  [USB-C-SMD_TYPEC-304-BCP16-1]
sheet PERF2
C225  2.2uF  [c0201 nsk]
C226  100nF  [c0201 nsk]
C227  100nF  [c0201 nsk]
C228  2.2uF  [c0201 nsk]
C229  100nF  [c0201 nsk]
C230  100nF  [c0201 nsk]
C231  2.2uF  [c0201 nsk]
C232  100nF  [c0201 nsk]
C233  100nF  [c0201 nsk]
C234  2.2uF  [c0201 nsk]
C235  100nF  [c0201 nsk]
C236  100nF  [c0201 nsk]
C276  2.2uF  [c0201 nsk]
C277  2.2uF  [c0201 nsk]
D16  0402ESDA-05N  [D0402]
D17  0402ESDA-05N  [D0402]
D18  0402ESDA-05N  [D0402]
D19  0402ESDA-05N  [D0402]
D20  0402ESDA-05N  [D0402]
D21  0402ESDA-05N  [D0402]
D22  0402ESDA-05N  [D0402]
D23  0402ESDA-05N  [D0402]
FPC1  FPC-05FB-50PH20  [FPC-SMD_50P-P0.50_FPC-05FB-50PH20]
H1  12251220ANG0S115001  [HDR-TH_40P-P2.54-V-M-R2-C20-S2.54]
LED2  WS2812B-2020  [LED-SMD_4P-L2.0-W2.0-TL_WS2812B-2020]
LED3  WS2812B-2020  [LED-SMD_4P-L2.0-W2.0-TL_WS2812B-2020]
LED4  WS2812B-2020  [LED-SMD_4P-L2.0-W2.0-TL_WS2812B-2020]
LED5  WS2812B-2020  [LED-SMD_4P-L2.0-W2.0-TL_WS2812B-2020]
R63  10K  [r0201 nsk]
R115  6K8  [r0201 nsk]
R116  6K8  [r0201 nsk]
R119  100K  [r0201 nsk]
R126  10  [R0402-NSK]
SIM1  1040310811  [SIM-SMD_8P-1040310811]
TFT1  -  [TFT_1.14寸_0.7MM-13P]
U8  -  [FBGA-153_L13.0-W11.5]
U16  SY6280AAC  [SOT-23-5_L3.0-W1.7-P0.95-LS2.8-BL]
sheet PERF3
C237  2.2uF  [c0402-nsk]
C238  100nF  [c0201 nsk]
C239  33pF  [c0201 nsk]
C240  100nF  [c0201 nsk]
C241  100nF  [c0201 nsk]
C242  100nF  [c0402-nsk]
C243  100nF  [c0402-nsk]
C244  NC  [c0201 nsk]
C245  NC  [c0201 nsk]
C246  100nF  [c0402-nsk]
C247  2.2uF  [c0402-nsk]
CGQ1  IRM-H638T/TR2  [SENSOR-SMD_IRM-H638T-TR2-TL]
CN2  PJ-327A0-SMT  [AUDIO-SMD_PJ-327A0-SMT]
CN3  0533980271  [CONN-SMD_2P-P1.25_053398-0X71]
R64  2K  [r0201 nsk]
R65  10K  [r0201 nsk]
R66  10K  [r0201 nsk]
R67  22  [r0201 nsk]
R68  22  [r0201 nsk]
R69  10K  [r0201 nsk]
R70  10K  [r0201 nsk]
R72  0  [r0201 nsk]
R73  10K  [r0201 nsk]
R74  10K  [r0201 nsk]
R75  10K  [r0201 nsk]
R76  10K  [r0201 nsk]
R77  60  [r0201 nsk]
R78  60  [r0201 nsk]
R122  0  [r0201 nsk]
R124  10k  [r0201 nsk]
R125  33  [r0201 nsk]
RF1  BWIPX-1-001E  [IPEX-SMD_BWIPX-1-001E]
U9  AIC8800D  [LGA-44_L12.0-W12.0-P0.90]
U11  TJA1051T  [SOP-8_L4.9-W3.9-P1.27-LS6.0-BL]
U18  W25N01GVZEIG  [WSON-8_L8.0-W6.10-P1.27-BL-EP]
sheet POWER
U14  T527  [T527-BGA664]  (sections Audio_ADC,DRAM,GND,IO_1,IO_2,PERF,SoC,VCC)

## Library data of the parts
C1-C3 C7 C8 C281 C282 = CAP_0603: Supplier Footprint: 0603
C4 C9 C10 C200 C221-C224 C237 C242 C243 C246 C247 C280 = CAP_0402: Supplier Footprint: 0402
C5 C6 = CAP_0805: Supplier Footprint: 0805
CN3 CN4 = 0533980271: 插针结构:1x2P;间距:1.25mm;安装方式:立贴;参考系列:-;总PIN数:2P;排数:1;每排PIN数:2;行距:-;额定电流:-;触头材质:磷青铜;触头镀层:锡;工作温度范围:-;; LCSC Part Name: 1x2P 间距:1.25mm 立贴; Supplier Part: C122410; Manufacturer: MOLEX; Supplier Footprint: SMD,P=1.25mm; JLCPCB Part Class: 扩展库; Datasheet: https://atta.szlcsc.com/upload/public/pdf/source/20170721/C122410_1500619309943834053.pdf; Supplier: LCSC; Pins Structure: 1x2P; Pitch: 1.25mm; Mounting Style: 立贴; Number of Pins: 2P; Number of Rows: 1; Number of PINs Per Row: 2; Contact Material: 磷青铜; Contact Plating: 锡
D1 = B5819WS_C22624: 正向压降(Vf):600mV@1A;直流反向耐压(Vr):40V;平均整流电流(Io):1A;; LCSC Part Name: 电压:40V 电流:1A; Supplier Part: C22624; Manufacturer: CJ(江苏长电/长晶); Supplier Footprint: SOD-323; JLCPCB Part Class: 扩展库; Datasheet: https://atta.szlcsc.com/upload/public/pdf/source/20150407/1457707273359.pdf; Supplier: LCSC; Forward Voltage (Vf@If): 600mV@1A; Reverse Voltage (Vr): 40V; Average Rectified Current (Io): 1A
D2 = SMCJ15CA_C438202: Supplier Part: C438202; Manufacturer: 晶导微电子; Supplier Footprint: SMC; JLCPCB Part Class: 扩展库; Datasheet: https://atta.szlcsc.com/upload/public/pdf/source/20191016/C438242_A63B17745ADA505032D55B9AC6D6140F.pdf; Supplier: LCSC
D3 D4 = SS54_C22452: 正向压降(Vf):550mV@5A;直流反向耐压(Vr):40V;平均整流电流(Io):5A;; LCSC Part Name: 电压:40V 电流:5A; Supplier Part: C22452; Manufacturer: MDD; Supplier Footprint: SMA(DO-214AC); JLCPCB Part Class: 基础库; Datasheet: https://atta.szlcsc.com/upload/public/pdf/source/20230314/529CD85F9B31F69841D3A079BC07E377.pdf; Supplier: LCSC; Forward Voltage (Vf@If): 550mV@5A; Reverse Voltage (Vr): 40V; Average Rectified Current (Io): 5A; Reverse Leakage Current (Ir): 1mA@40V
DC1 = DC-044A-A200: 连接器类型:DC电源插座;安装方式:弯插;触点内径:2mm;触点外径:5.9mm;额定电流:3A;额定电压:30V;工作温度范围:-20℃~+70℃;; LCSC Part Name: DC电源插座 内径:2mm 外径:5.9mm; Supplier Part: C720575; Manufacturer: XUNPU(讯普); Supplier Footprint: 插件; JLCPCB Part Class: 扩展库; Datasheet: https://atta.szlcsc.com/upload/public/pdf/source/20200812/C720575_4790492998F066C820F633EA8FAFF763.pdf; Supplier: LCSC; Connector Type: DC电源插座; Mounting Style: 弯插; Inside Contact Diameter: 2mm; Outside Contact Diameter: 5.9mm; Current Rating (Max): 3A; Voltage Rating (Max): 30V; Operating Temperature Range: -20℃~+70℃
L1 = FXL0630-4R7-M: 电感值:4.7uH;精度:±20%;额定电流:6A;饱和电流(Isat):9A;类型:一体成型电感;; LCSC Part Name: 4.7uH ±20% 9A; Supplier Part: C167220; Manufacturer: cjiang(长江微电); Supplier Footprint: SMD,6.6x7mm; JLCPCB Part Class: 扩展库; Datasheet: https://atta.szlcsc.com/upload/public/pdf/source/20230516/3A080F5AF8C87BB81C3BA86E5F60E51A.pdf; Supplier: LCSC; Tolerance: ±20%; Rated Current: 6A; Saturation Current (Isat): 9A; DC Resistance (DCR): 33mΩ; Type: 一体成型电感
Q1 = YJL2305A: 类型:P沟道;漏源电压(Vdss):15V;连续漏极电流(Id):5.6A;功率(Pd):1.2W;导通电阻(RDS(on)@Vgs,Id):25mΩ@4.5V,5.6A;阈值电压(Vgs(th)@Id):1V@250uA;; LCSC Part Name: P沟道 耐压:15V 电流:5.6A; Supplier Part: C699306; Manufacturer: YANGJIE(扬杰); Supplier Footprint: SOT-23(TO-236); JLCPCB Part Class: 扩展库; Datasheet: https://atta.szlcsc.com/upload/public/pdf/source/20200709/C699306_A321381AA1EB3D502A51672BD4542002.pdf; Supplier: LCSC; Type: P沟道; Drain Source Voltage (Vdss): 15V; Continuous Drain Current (Id): 5.6A; Power Dissipation (Pd): 1.2W; Drain Source On Resistance (RDS(on)@Vgs,Id): 25mΩ@4.5V,5.6A; Gate Threshold Voltage (Vgs(th)@Id): 1V@250uA; Total Gate Charge (Qg@Vgs): 7.2nC@4.5V; Input Capacitance (Ciss@Vds): 890pF@9V; Reverse Transfer Capacitance (Crss@Vds): 85pF@9V; Operating Temperature: -55℃~+150℃@(Tj)
R1 R2 = Res_0603: Supplier Footprint: 0603
R3-R8 R126 = Res_0402: Supplier Footprint: 0402
U1 U2 = RVT1H101M0607: 容值:100uF;精度:±20%;额定电压:50V;纹波电流:229mA@120Hz;; LCSC Part Name: 100uF ±20% 50V; Supplier Part: C3151829; Manufacturer: ROQANG(容强); Supplier Footprint: SMD,D6.3xL7.7mm; JLCPCB Part Class: 扩展库; Datasheet: https://atta.szlcsc.com/upload/public/pdf/source/20170325/1490427950282.pdf; Supplier: LCSC; Tolerance: ±20%; Rated Voltage: 50V; Ripple Current: 229mA@120Hz; φD: 6.3mm; L: 7.7mm; Lifetime @ Temp: 2000hrs@105℃; Operating Temperature: -40℃~+105℃
U3 = TPS54531DDAR: 功能类型:降压型;输出类型:可调;输入电压:3.5V~28V;输出电压:800mV~26.04V;输出电流(最大值):5A;; Supplier Part: C50605; Manufacturer: TI(德州仪器); Supplier Footprint: SOIC-8-EP; JLCPCB Part Class: 扩展库; Datasheet: https://www.ti.com/cn/lit/gpn/tps54531; Supplier: LCSC; Function: 降压型; Output Type: 可调; Input Voltage: 3.5V~28V; Output Voltage: 800mV~26.04V; Output Current (Max): 5A; Switching Frequency: 570kHz; Operating Temperature: -40℃~+85℃@(TA); Synchronous Rectification: 否; Number of Outputs: 1; Topology: 降压式; Switch tube (built-in/external): 内置
FPC2 = FPC-05FB-30PH20: 锁定特性:翻盖式;触点类型:双侧触点/上下接;触点数量:30P;间距:0.5mm;安装类型:卧贴;工作温度范围:-25℃~+85℃;; LCSC Part Name: 间距:0.5mm P数:30P 翻盖式 双侧触点/上下接; Supplier Part: C2856833; Manufacturer: XUNPU(讯普); Supplier Footprint: SMD,P=0.5mm,卧贴; JLCPCB Part Class: 扩展库; Datasheet: https://atta.szlcsc.com/upload/public/pdf/source/20210922/C2856833_974F2E309F01E02BEE862D1FB45F93FA.pdf; Supplier: LCSC; Locking Feature: 翻盖式; Contact Type: 双侧触点/上下接; Number of Contacts: 30P; Pitch: 0.5mm; Mounting Type: 卧贴; FFC, FCB Thickness: 0.3mm; Height Above Board: 2mm; Operating Temperature Range: -25℃~+85℃
R44-R57 R59-R70 R72-R80 R82 R83 R85 R86 R88-R98 R100 R101 R103 R104 R106-R122 R124 R125 R127-R130 = Res_0201: Supplier Footprint: 0201
C248 C255 C294 = CAP_1206: Supplier Footprint: 1206
C225 C228 C231 C234 C249 C250 C253 C254 C256 C258 C260-C277 = 0201X225M6R3NT: 容值:2.2uF;精度:±20%;额定电压:6.3V;材质(温度系数):X5R;; LCSC Part Name: 2.2uF ±20% 6.3V; Supplier Part: C285111; Manufacturer: FH(风华); Supplier Footprint: 0201; JLCPCB Part Class: 扩展库; Datasheet: https://atta.szlcsc.com/upload/public/pdf/source/20180913/C285111_405173511BA094D64E8CAA96F7E40A73.pdf; Supplier: LCSC; Tolerance: ±20%; Voltage Rated: 6.3V; Temperature Coefficient: X5R
C251 C252 C257 C259 = 0201CG220J500NT: 容值:22pF;精度:±5%;额定电压:50V;材质(温度系数):C0G;; LCSC Part Name: 22pF ±5% 50V; Supplier Part: C57783; Manufacturer: FH(风华); Supplier Footprint: 0201; JLCPCB Part Class: 扩展库; Datasheet: https://atta.szlcsc.com/upload/public/pdf/source/20200305/C486355_26A10D38EF8C2A5C37091D0039909270.pdf; Supplier: LCSC; Tolerance: ±5%; Voltage Rated: 50V; Temperature Coefficient: C0G
L9 L10 = WPN252012H2R2MT: 电感值:2.2uH;精度:±20%;额定电流:1.9A;饱和电流(Isat):3A;类型:-;; LCSC Part Name: 2.2uH ±20% 3A; Supplier Part: C98350; Manufacturer: Sunlord(顺络); Supplier Footprint: 1008; JLCPCB Part Class: 扩展库; Datasheet: https://atta.szlcsc.com/upload/public/pdf/source/20231024/AA72387348CB63159A6CBE41DDE5ECDA.pdf; Supplier: LCSC; Tolerance: ±20%; Rated Current: 1.9A; Saturation Current (Isat): 3A; DC Resistance (DCR): 120mΩ
RJ1 RJ2 = HR911130A: 连接器类型:RJ插座;USOC代码:RJ45;端口数量:1;等级:-;屏蔽:-;LED:有;; LCSC Part Name: RJ45; Supplier Part: C54408; Manufacturer: HANRUN(汉仁); Supplier Footprint: 插件; JLCPCB Part Class: 扩展库; Datasheet: https://atta.szlcsc.com/upload/public/pdf/source/20151014/1457707458393.pdf; Supplier: LCSC; Connector Type: RJ插座; USOC Codes: RJ45; Number of Ports: 1; LED: 有
U12 U13 = RTL8211F-CG: 应用功能:-;通道数:-;接口类型:-;; Supplier: LCSC; Supplier Part: C187932; Manufacturer: REALTEK(瑞昱); JLCPCB Part Class: 扩展库; LCSC Part Name: 集成10/100/1000M以太网精密收发器; Supplier Footprint: WQFN-40-EP(5x5); Datasheet: https://atta.szlcsc.com/upload/public/pdf/source/20190902/C187932_1913F3711F05FE1324DF2946D70D648D.pdf
X3 X4 = 7D025000Q01: 晶振类型:贴片晶振;频率:25MHz;常温频差:±10ppm;外接负载电容:18pF;频率稳定度(全温):±20ppm;; LCSC Part Name: 25MHz ±10ppm 18pF; Supplier Part: C648942; Manufacturer: HD(浩都频率); Supplier Footprint: SMD2016-4P; JLCPCB Part Class: Extended Part; Datasheet: https://atta.szlcsc.com/upload/public/pdf/source/20220223/891C6A51CC6F69B73E92651637DFAA51.pdf; Supplier: LCSC; Crystal Type: 贴片晶振; Normal temperature Frequency Tolerance: ±10ppm; External load capacitor: 18pF; Frequency Stability(Full temperature range): ±20ppm
C189-C199 C201 C202 C204 C208-C211 C213-C216 C218-C220 C226 C227 C229 C230 C232 C233 C235 C236 C238-C241 C244 C245 = GRM033R61A104KE15D: 容值:100nF;精度:±10%;额定电压:10V;材质(温度系数):X5R;; LCSC Part Name: 100nF ±10% 10V; Supplier Part: C76934; Manufacturer: muRata(村田); Supplier Footprint: 0201; JLCPCB Part Class: Extended Part; Datasheet: https://atta.szlcsc.com/upload/public/pdf/source/20180307/C76934_15204090982891407723.pdf; Supplier: LCSC; Tolerance: ±10%; Voltage Rated: 10V; Temperature Coefficient: X5R
D5 D6 D8 D10-D15 = RClamp0524PATCT_C40960: 反向截止电压(Vrwm):5V;最大钳位电压:15V;峰值脉冲功率(Ppp)@10/1000us:150W;击穿电压:6V;; Supplier Part: C40960; Manufacturer: SEMTECH; Supplier Footprint: SLP2510-8; JLCPCB Part Class: 扩展库; Datasheet: https://atta.szlcsc.com/upload/public/pdf/source/20150124/1457707260739.pdf; Supplier: LCSC; Reverse Stand-Off Voltage (Vrwm): 5V; Maximum Clamping Voltage: 15V; Peak Pulse Power Dissipation (Ppp)@10/1000us: 150W; Breakdown Voltage: 6V; Number of Lines: 四路; Operating Temperature: -55℃~+125℃@(Tj); Type: ESD
D7 D9 = B5819WT_C2997265: 二极管配置:-;正向压降(Vf):600mV@200mA;直流反向耐压(Vr):40V;平均整流电流(Io):1A;; LCSC Part Name: 电压:40V 电流:1A; Supplier Part: C2997265; Manufacturer: BORN(伯恩半导体); Supplier Footprint: SOD-523; JLCPCB Part Class: 扩展库; Datasheet: https://atta.szlcsc.com/upload/public/pdf/source/20220826/529B3A9034D5C6632B715AD177467069.pdf; Supplier: LCSC; Forward Voltage (Vf@If): 600mV@200mA; Reverse Voltage (Vr): 40V; Average Rectified Current (Io): 1A; Reverse Leakage Current (Ir): 5uA@30V
D24-D27 D30 D31 = 0402ESDA-05N: 极性:Bidirectional;反向关断电压（典型值）:5V;击穿电压（最小值）:-;箝位电压:50V;峰值脉冲电流（10/1000us）:-;; Supplier Part: C316049; Manufacturer: BORN伯恩半导体; Supplier Footprint: 0402; JLCPCB Part Class: Extended Part; Datasheet: https://atta.szlcsc.com/upload/public/pdf/source/20181026/C316049_37ABAC87650F175221BFB473159300DE.pdf; Supplier: LCSC; Polarity: Bidirectional; Reverse Stand-Off Voltage (Vrwm): 5V; Clamping Voltage@Ipp: 50V; Voltage - Reverse Standoff (Typ): 5V; Voltage - Clamping (Max) @ Ipp: 50V
D32 = 1N5819WS_C191023: 正向压降(Vf):600mV@1A;直流反向耐压(Vr):40V;平均整流电流(Io):1A;; LCSC Part Name: 电压:40V 电流:1A; Supplier Part: C191023; Manufacturer: Hottech(合科泰); Supplier Footprint: SOD-323; JLCPCB Part Class: 基础库; Datasheet: https://atta.szlcsc.com/upload/public/pdf/source/20220428/3CB86FD8D28D653594B4E35F9D5AEFD9.pdf; Supplier: LCSC; Forward Voltage (Vf@If): 600mV@1A; Reverse Voltage (Vr): 40V; Average Rectified Current (Io): 1A
U15 = DP_TH_SIDE_VERTICAL
U16 U17 = SY6280AAC_C55136: 低能耗配电开关; Supplier Part: C55136; Manufacturer: silergy(矽力杰); Supplier Footprint: SOT-23-5; JLCPCB Part Class: 扩展库; Datasheet: https://atta.szlcsc.com/upload/public/pdf/source/20161108/1478586372822.pdf; Supplier: LCSC
USB1 = HDMI-001C_C2836126: 连接器类型:HDMI;公母:母;总PIN位数:19P;安装方式:弯插;排数:2;额定电流:500mA;触头材质:-;触头镀层:-;工作温度范围:-45℃~+85℃;; LCSC Part Name: HDMI 母 P数:19P; Supplier Part: C2836126; Manufacturer: XUNPU(讯普); Supplier Footprint: 弯插; JLCPCB Part Class: 扩展库; Datasheet: https://atta.szlcsc.com/upload/public/pdf/source/20200810/C720617_FFAEEC9A8F7AC9847E6A422865303F15.pdf; Supplier: LCSC; Connector Type: HDMI; Gender: 母; Number of Pins: 19P; Mounting Style: 弯插; Number of Rows: 2; Current Rating (Max): 500mA; Operating Temperature Range: -45℃~+85℃
USB2 = USB-303WSD-BRY: 连接器类型:Type-A;标准:USB 3.0;公母:母;端口数量:2;触点数量:9P+9P;安装方式:弯插;额定电流 - 电源:1.8A;工作温度范围:-30℃~+85℃;焊接温度(最大值):260℃;; LCSC Part Name: Type-A 母 弯插; Supplier Part: C2895028; Manufacturer: XUNPU(讯普); Supplier Footprint: 插件; JLCPCB Part Class: 扩展库; Datasheet: https://atta.szlcsc.com/upload/public/pdf/source/20230426/A73C665BA3413059F595E5846F1512B5.pdf; Supplier: LCSC; Connector Type: Type-A; Standard: USB 3.0; Gender: 母; Number of Ports: 2; Number of Contacts: 9P+9P; Mounting Style: 弯插; Current Rating - Power (Max): 1.8A; Operating Temperature Range: -30℃~+85℃; Soldering Temperature(Max): 260℃
USB3 = TYPEC-304-BCP16: Pin Type: IN; Supplier: LCSC; Supplier Part: C720629; Manufacturer: XUNPU; JLCPCB Part Class: 扩展库; Check: false
D16-D23 = 0402ESDA-05N: 极性:双向;反向截止电压(Vrwm):5V;最大钳位电压:50V;; LCSC Part Name: 双向ESD; Supplier Part: C316049; Manufacturer: BORN(伯恩半导体); Supplier Footprint: 0402; JLCPCB Part Class: Extended Part; Datasheet: https://atta.szlcsc.com/upload/public/pdf/source/20181026/C316051_3197CA7AF3730883CA62970815D4F79F.pdf; Supplier: LCSC; polarity: 双向; Reverse Stand-Off Voltage (Vrwm): 5V; Maximum Clamping Voltage: 50V; Type: ESD
FPC1 = FPC-05FB-50PH20: LCSC Part Name: 50P 0.5mm; Supplier Part: C2856838; Manufacturer: XUNPU(讯普); Supplier Footprint: SMD; JLCPCB Part Class: 扩展库; Supplier: LCSC
H1 = 12251220ANG0S115001: 插针结构:2x20P;间距:2.54mm;行距:2.54mm;圆针/方针:方针;安装类型:直插;排数:双排;总PIN位数:40P;额定电流:3A;额定电压:-;配合针长度:6mm;塑高:2.5mm;端接针长度:3mm;触头材质:黄铜;触头镀层:-;工作温度范围:-40℃~+105℃;颜色:黑色;; LCSC Part Name: 间距:2.54mm 2x20P 直插 方针; Supplier Part: C429965; Manufacturer: JILN(锦凌); Supplier Footprint: 插件,P=2.54mm; JLCPCB Part Class: 扩展库; Datasheet: https://atta.szlcsc.com/upload/public/pdf/source/20190920/C429965_BC46B4ED575BB92CEF1C6420E537C4AD.pdf; Supplier: LCSC; Pin Structure: 2x20P; Pitch: 2.54mm; Row Spacing: 2.54mm; Circluar Pins/Square Pins: 方针; Mounting Type: 直插; Number of Rows: 双排; Number of Pins: 40P; Current Rating (Max): 3A; Length of Mating Pin: 6mm; Insulation Height: 2.5mm; Length of End Connection Pin: 3mm; Contact Material: 黄铜; Operating Temperature Range: -40℃~+105℃; Color: 黑色
LED2-LED4 = WS2812B-2020: 发光颜色:RGB三色;二极管配置:-;透镜颜色:-;主波长:470.4nm；622.5nm；515.6nm;峰值波长:-;色温:-;测试电流:12mA;功率:-;发光角度:-;安装方式:-;工作温度:-;; LCSC Part Name: RGB三色 470.4nm 515.6nm 622.5nm （注意防潮，请查阅规格书中对应具体内容）; Supplier Part: C965555; Manufacturer: worldsemi; Supplier Footprint: SMD,2x2mm; JLCPCB Part Class: Extended Part; Datasheet: https://atta.szlcsc.com/upload/public/pdf/source/20201203/C965555_5C919C4B6231E6ADE06011FB0D94282B.pdf; Supplier: LCSC; Emitted Color: RGB三色; Dominant Wavelength: 470.4nm；622.5nm；515.6nm; Forward Current: 12mA
LED5 = WS2812B-2020: 发光颜色:RGB三色;二极管配置:-;透镜颜色:-;主波长:470.4nm；622.5nm；515.6nm;峰值波长:-;色温:-;测试电流:12mA;功率:-;发光角度:-;安装方式:-;工作温度:-;; LCSC Part Name: RGB三色 470.4nm 515.6nm 622.5nm （注意防潮，请查阅规格书中对应具体内容）; Supplier Part: C965555; Manufacturer: worldsemi; Supplier Footprint: SMD,2x2mm; JLCPCB Part Class: Extended Part; Datasheet: https://atta.szlcsc.com/upload/public/pdf/source/20201203/C965555_5C919C4B6231E6ADE06011FB0D94282B.pdf; Supplier: LCSC; Emitted Color: RGB三色; Dominant Wavelength: 470.4nm；622.5nm；515.6nm; Forward Current: 12mA; NO_CONNECT: yes
SIM1 = 1040310811: 卡连接方式:拔插式;卡类型:MicroSD卡(TF卡);连接器类型:卡座;本体最大高度:1.42mm;触头镀层:金;工作温度范围:-;; LCSC Part Name: 拔插式 MicroSD卡(TF卡) 卡座; Supplier Part: C585350; Manufacturer: MOLEX; Supplier Footprint: SMD; JLCPCB Part Class: 扩展库; Datasheet: https://atta.szlcsc.com/upload/public/pdf/source/20201117/C585350_D1F0B30BD23514449186B2E50ACE8BBF.pdf; Supplier: LCSC; Card Connection Mode: 拔插式; Card Type: MicroSD卡(TF卡); Connector Type: 卡座; Maximum Body Height: 1.42mm; Contact Plating: 金
TFT1 = 1.14 IPS DISPLAY ST7789V: Pin Type: IN
U8 = EMMC BGA153: Pin Type: IN; Supplier: LCSC; Supplier Part: C577446; Manufacturer: Kingston(金士顿); Manufacturer Part: EMMC04G-M627-A01
CGQ1 = IRM-H638T/TR2: 工作电压:2.7V~5.5V;工作电流:1.2mA;接收距离:-;中心频率:-;接收角度:-;; LCSC Part Name: 45°@水平 45°@垂直; Supplier Part: C91447; Manufacturer: EVERLIGHT(亿光); Supplier Footprint: SMD-4P,4x5mm; JLCPCB Part Class: 扩展库; Datasheet: https://atta.szlcsc.com/upload/public/pdf/source/20161219/1482143954829.pdf; Supplier: LCSC; Supply Voltage: 2.7V~5.5V; Supply Current: 1.2mA; Operating Temperature: -25℃~+85℃
CN2 = PJ-327A0-SMT: 连接器类型:3.5mm耳机座;额定电流:500mA;额定电压:30V;工作温度范围:-20℃~+70℃;焊接温度(最大值):235℃;; LCSC Part Name: 3.5mm耳机座; Supplier Part: C381135; Manufacturer: XKB Connectivity(中国星坤); Supplier Footprint: SMD; JLCPCB Part Class: 扩展库; Datasheet: https://atta.szlcsc.com/upload/public/pdf/source/20211011/16B83D74DCFBFB52BBA1016D248FDA16.pdf; Supplier: LCSC; Connector Type: 3.5mm耳机座; Current Rating (Max): 500mA; Voltage Rating (Max): 30V; Operating Temperature Range: -20℃~+70℃; Soldering Temperature(Max): 235℃
RF1 = BWIPX-1-001E: 连接器类型:板端;接口类型:内针;频率-最大值:6GHz;接口直径:-;射频系列:IPEX;端口数量:1;阻抗:50Ω;样式:-;接口长度/高度:-;工作温度范围:-;; LCSC Part Name: IPEX 内针 IPEX内针 天线座 IPEX-1 IPEX1 1代; Supplier Part: C496552; Manufacturer: BAT WIRELESS(蝙蝠无线); Supplier Footprint: SMD; JLCPCB Part Class: 扩展库; Datasheet: https://atta.szlcsc.com/upload/public/pdf/source/20201223/C496552_05E5A9956EAE1A8819C5051D085B1DED.pdf; Supplier: LCSC; Connector Type: 板端; Interface Type: 内针; Frequency-Max: 6GHz; RF Series: IPEX; Number of Ports: 1; Impedance: 50Ω
U9 = XR829MQ: Supplier Part: C3039827; Supplier Footprint: LCC-44_L12.0-W12.0-P0.90; JLCPCB Part Class: 扩展库; Datasheet: https://atta.szlcsc.comnull; Supplier: LCSC
U11 = TJA1051T_C7432801: 类型:收发器;数据速率:5Mbps;; Supplier Part: C7432801; Manufacturer: Tokmas(托克马斯); Supplier Footprint: SOP-8; JLCPCB Part Class: Extended Part; Datasheet: https://atta.szlcsc.com/upload/public/pdf/source/20230625/004DEA3E98C57C3FE97F8CC2FD188F8A.pdf; Supplier: LCSC; Type: 收发器; Data Rate: 5Mbps
U18 = W25N01GVZEIG_C88868: 1-Gbit(128M x 8bit)，SPI接口，工作电压：2.7V to 3.6V; Supplier Part: C88868; Manufacturer: WINBOND(华邦); Supplier Footprint: WSON-8-EP(6.1x8); JLCPCB Part Class: 扩展库; Datasheet: https://atta.szlcsc.com/upload/public/pdf/source/20180428/C88868_D3C946FD371B1278FED16ED9DB2A4B79.pdf; Supplier: LCSC
U14 = T527: Allwinner T527 SoC; SWAP_INFO: (S1+S2+S3+S4+S5+S6+S7+S8+S9); SPLIT_INST: TRUE

## Nets
GND: C1.1 C2.1 C3.1 C5.1 C6.1 C7.1 C8.1 C10.2 C189.1 C200.1 C201.1 C202.1 C204.1 C208.1 C209.1 C210.1 C211.1 C213.1 C214.1 C215.1 C216.1 C218.1 C221.1 C222.1 C223.1 C224.1 C225.2 C226.1 C227.1 C228.2 C229.1 C230.1 C231.2 C232.1 C233.1 C234.2 C235.1 C236.1 C237.1 C240.1 C244.1 C245.1 C246.1 C247.1 C248.1 C249.2 C250.2 C251.1 C252.1 C253.2 C254.2 C255.1 C256.2 C257.1 C258.2 C259.1 C260.2 C261.2 C262.2 C263.2 C264.2 C265.2 C266.2 C267.2 C268.1 C269.2 C270.2 C271.2 C272.2 C273.2 C274.2 C275.1 C276.2 C277.1 C280.1 C281.1 C282.1 C294.1 CGQ1.1(GND) CGQ1.2(GND) CN3.3 CN3.4 CN4.1 CN4.3 CN4.4 D2.1 D4.1(A) D5.3(GND) D5.8(GND) D6.3(GND) D6.8(GND) D8.3(GND) D8.8(GND) D10.3(GND) D10.8(GND) D11.3(GND) D11.8(GND) D12.3(GND) D12.8(GND) D13.3(GND) D13.8(GND) D14.3(GND) D14.8(GND) D15.3(GND) D15.8(GND) D16.2 D17.1 D18.2 D19.1 D20.2 D21.1 D22.2 D23.1 D24.1 D25.1 D26.1 D27.1 D30.1 D31.1 DC1.2 DC1.3 FPC1.5 FPC1.6 FPC1.31 FPC1.39 FPC1.44 FPC1.50 FPC1.51 FPC1.52 FPC2.5 FPC2.8 FPC2.11 FPC2.14 FPC2.17 FPC2.20 FPC2.23 FPC2.25 FPC2.29 FPC2.30 FPC2.31 FPC2.32 H1.6 H1.9 H1.14 H1.20 H1.25 H1.30 H1.34 H1.39 LED2.2(GND) LED3.2(GND) LED4.2(GND) LED5.2(GND) R2.1 R6.1 R7.2 R8.1 R44.1 R45.2 R46.1 R49.1 R55.1 R56.1 R57.1 R59.1 R60.1 R62.1 R67.1 R68.1 R76.2 R82.1 R85.1 R86.1 R93.1 R94.1 R95.1 R96.1 R100.1 R103.1 R104.1 R111.1 R112.1 R113.1 R114.1 R115.1 R116.2 R117.2 R118.1 R119.1 R121.1 R122.1 R129.1 R130.1 RF1.2(GND) RF1.3(GND) RJ1.P10 RJ1.SHIELD0 RJ1.SHIELD1 RJ2.P10 RJ2.SHIELD0 RJ2.SHIELD1 SIM1.6(VSS) SIM1.9 SIM1.10 SIM1.12 SIM1.13 SIM1.14 TFT1.8(GND) TFT1.11(LED-) TFT1.13(GND) U1.2 U2.2 U3.7(GND) U3.9(EP) U8.A6(VSS) U8.C4(VSSQ) U8.E7(VSS) U8.G5(VSS) U8.H10(VSS) U8.J5(VSS) U8.K8(VSS) U8.N2(VSSQ) U8.N5(VSSQ) U8.P4(VSSQ) U8.P6(VSSQ) U9.1(GND1) U9.3(GND2) U9.20(GND3) U9.31(GND4) U9.33(GND5) U9.36(GND6) U11.2(GND) U12.41(GND) U13.41(GND) U14.A32(AVSS0) U14.A33(AVSS1) U14.B21(PCIE-REF-CLKP) U14.C21(PCIE-REF-CLKN) U14.C22(AVSS2) U14.C24(AVSS3) U14.C26(AVSS4) U14.C28(AVSS5) U14.C30(AVSS6) U14.C31(AVSS7) U14.E29(AVSS8) U14.F22(AVSS9) U14.F24(AVSS10) U14.G26(AVSS11) U14.G28(AVSS12) U14.H24(AVSS13) U14.J17(AVSS14) U14.J21(AVSS15) U14.J22(AVSS16) U14.J23(AVSS17) U14.J26(AVSS18) U14.K15(AVSS19) U14.K16(AVSS20) U14.K21(AVSS21) U14.K22(AVSS22) U14.K24(AVSS23) U14.K25(AVSS24) U14.L16(AVSS25) U14.L19(AVSS26) U14.L24(AVSS27) U14.M16(AVSS28) U14.M18(AVSS29) U14.M19(AVSS30) U15.2(GND) U15.5(GND) U15.8(GND) U15.11(GND) U15.16(GND) U15.19(RETURN) U15.21(GND) U15.22(GND) U15.23(GND) U15.24(GND) U16.2(GND) U17.2(GND) U18.4(GND) U18.9(EP) USB1.2(TMDSData2Shield) USB1.5(TMDSData1Shield) USB1.8(TMDSData0Shield) USB1.11(TMDSClockShield) USB1.14(Reserved(N.C.)) USB1.17(DDC/CECGround) USB1.20(EH) USB2.4(GND1) USB2.7(GND_DRAIN1) USB2.13(GND2) USB2.16(GND_DRAIN2) USB2.19(Shield) USB2.20(Shield) USB2.21(Shield) USB2.22(Shield) USB3.12(1) USB3.13(2) USB3.14(3) USB3.15(4) USB3.A1B12(GND) USB3.B1A12(GND) X3.2(GND) X3.4(GND) X4.2(GND) X4.4(GND) ; also on sheet 1 2 3 4 5
VBUS: C221.2 C222.2 C246.2 C247.2 C280.2 C294.2 D1.2(A) D3.2(K) D9.2(A) FPC1.1 FPC1.2 H1.2 H1.4 LED2.4(VDD) LED3.4(VDD) LED4.4(VDD) LED5.4(VDD) R52.1 R53.1 U11.3(VCC) U17.5(IN) USB2.1(VBUS1) USB2.10(VBUS2) ; also on sheet 1
VBUS-USB: C281.2 C282.2 D32.1(K) USB3.A4B9(VBUS) USB3.B4A9(VBUS)
VCC-3V3-BLK: C277.2 R126.2 U16.1(OUT)
AP-WAKE-BT: R69.2 U9.6(BT-WAKE) ; also on sheet 4
AXP717-CC1: D24.2 R130.2 USB3.A5(CC1)
AXP717-CC2: D31.2 R129.2 USB3.B5(CC2)
BLDO1: R69.1 R70.1 U9.22(VDDIO) ; also on sheet 1 4 5
BLDO3: C201.2 C202.2 C208.2 C209.2 R127.1 R128.1 U14.J15(VCC18-PCIE) U14.L22(VCC18-EDP) U14.M21(VCC18-HDMI) ; also on sheet 1 2 5
BT-RESETN: U9.34(BT-RST-N) ; also on sheet 4
BT-WAKE-AP: R70.2 U9.7(BT-HOST-WAKE) ; also on sheet 4
CAN-RX0: U11.4(RXD) ; also on sheet 5
CAN-TX0: U11.1(TXD) ; also on sheet 5
CLDO1: C225.1 C226.2 C227.2 U8.C6(VCCQ) U8.M4(VCCQ) U8.N4(VCCQ) U8.P3(VCCQ) U8.P5(VCCQ) ; also on sheet 1 4
CLDO3: C228.1 C229.2 C230.2 C234.1 C235.2 C236.2 C249.1 D20.1 R47.1 R73.2 R74.2 R75.2 R83.1 R89.2 R91.2 SIM1.4(VDD) U8.E6(VCC) U8.F5(VCC) U8.J10(VCC) U8.K9(VCC) U12.28(DVDD_RG) U18.8(VCC) ; also on sheet 1 2 4
CPUX-RX: D30.2 H1.10 USB3.B8(SBU2) ; also on sheet 4
CPUX-TX: D27.2 H1.8 USB3.A8(SBU1) ; also on sheet 4
CTP-INT: FPC1.35 ; also on sheet 4
CTP-RST: FPC1.36 ; also on sheet 4
CTP-SCK: FPC1.37 ; also on sheet 4
CTP-SDA: FPC1.38 ; also on sheet 4
DCDC2: C210.2 C211.2 C213.2 C214.2 C215.2 C216.2 C218.2 U14.J16(VDD09-PCIE) U14.L18(VDD09-USB) U14.L21(VDD09-HDMI) U14.M22(VDD09-EDP) ; also on sheet 1
DCDC4: C200.2 C204.2 C223.2 C224.2 C250.1 C256.1 C258.1 C262.1 C263.1 C264.1 C269.1 C270.1 C271.1 C276.1 FPC1.3 FPC1.4 FPC2.2 FPC2.3 FPC2.4 H1.1 H1.17 R61.1 R88.1 R90.1 R92.2 R101.1 R106.1 R107.2 R108.1 R109.2 R110.2 R124.2 R125.2 RJ1.11 RJ1.14 RJ2.11 RJ2.14 TFT1.10(VDD) U9.9(VBAT) U11.5(N.C.) U12.11(AVDD33) U12.29(DVDD33) U12.40(AVDD33) U13.11(AVDD33) U13.28(DVDD_RG) U13.29(DVDD33) U13.40(AVDD33) U14.J18(VCC33-18-USB-2) U14.J19(VCC33-18-USB) U14.K19(VCC33-USB) U14.L17(VCC33-USB-2) U15.20(DP_PWR) U16.5(IN) ; also on sheet 1 4 5
DCIN-5V: C5.2 C6.2 D3.1(A) L1.2 R3.2
DCIN-12V: C1.2 C2.2 C7.2 Q1.2(S) R1.2 R4.2 U1.1 U2.1 U3.2(VIN)
DSP-UART-RX: H1.40 ; also on sheet 5
DSP-UART-TX: H1.37 ; also on sheet 5
EDP-AUXN: C199.1 U14.C33(EDP-AUXN)
EDP-AUXP: C198.1 U14.C32(EDP-AUXP)
EDP-HPD: D12.4(IN3) D12.7(NC) R60.2 U14.C29(EDP-HPD) U15.18(HOTPLUG)
EDP-TX0N: C191.1 U14.B29(EDP-TX0N)
EDP-TX0P: C190.1 U14.A29(EDP-TX0P)
EDP-TX1N: C193.1 U14.B30(EDP-TX1N)
EDP-TX1P: C192.1 U14.A30(EDP-TX1P)
EDP-TX2N: C195.1 U14.B31(EDP-TX2N)
EDP-TX2P: C194.1 U14.A31(EDP-TX2P)
EDP-TX3N: C197.1 U14.B33(EDP-TX3N)
EDP-TX3P: C196.1 U14.B32(EDP-TX3P)
EMMC-VDDI: C231.1 C232.2 C233.2 U8.C2(VDDI)
GM0_DVDD10: C253.1 C254.1 C265.1 C266.1 C267.1 C268.2 L9.2 U12.3(AVDD10) U12.8(AVDD10) U12.21(DVDD10) U12.38(AVDD10)
GM0_INTB: R88.2 U12.31(INTB/PMEB)
GM0_LED0: R92.1 U12.32(CFG_EXT/LED0)
GM0_LED1: R80.2 R94.2 U12.33(CFG_LDO0/LED1)
GM0_LED2: R79.1 R96.2 U12.34(CFG_LDO1/LED2)
GM0_MDIN0: RJ1.P3(MDI0-) U12.2(MDIN0)
GM0_MDIN1: RJ1.P7(MDI1-) U12.5(MDIN1)
GM0_MDIN2: RJ1.P6(MDI2-) U12.7(MDIN2)
GM0_MDIN3: RJ1.P9(MDI3-) U12.10(MDIN3)
GM0_MDIP0: RJ1.P2(MDI0+) U12.1(MDIP0)
GM0_MDIP1: RJ1.P4(MDI1+) U12.4(MDIP1)
GM0_MDIP2: RJ1.P5(MDI2+) U12.6(MDIP2)
GM0_MDIP3: RJ1.P8(MDI3+) U12.9(MDIP3)
GM0_REGOUT: L9.1 U12.30(REG_OUT/LDO_OUT)
GM0_RSET: R85.2 U12.39(RSET)
GM0_XTAL_IN: C252.2 U12.36(XTAL_IN) X3.1(IN)
GM0_XTAL_OUT: C251.2 U12.37(XTAL_OUT/EXT_CLK) X3.3(OUT)
GM1_DVDD10: C260.1 C261.1 C272.1 C273.1 C274.1 C275.2 L10.2 U13.3(AVDD10) U13.8(AVDD10) U13.21(DVDD10) U13.38(AVDD10)
GM1_INTB: R106.2 U13.31(INTB/PMEB)
GM1_LED0: R110.1 U13.32(CFG_EXT/LED0)
GM1_LED1: R98.2 R112.2 U13.33(CFG_LDO0/LED1)
GM1_LED2: R97.1 R114.2 U13.34(CFG_LDO1/LED2)
GM1_MDIN0: RJ2.P3(MDI0-) U13.2(MDIN0)
GM1_MDIN1: RJ2.P7(MDI1-) U13.5(MDIN1)
GM1_MDIN2: RJ2.P6(MDI2-) U13.7(MDIN2)
GM1_MDIN3: RJ2.P9(MDI3-) U13.10(MDIN3)
GM1_MDIP0: RJ2.P2(MDI0+) U13.1(MDIP0)
GM1_MDIP1: RJ2.P4(MDI1+) U13.4(MDIP1)
GM1_MDIP2: RJ2.P5(MDI2+) U13.6(MDIP2)
GM1_MDIP3: RJ2.P8(MDI3+) U13.9(MDIP3)
GM1_REGOUT: L10.1 U13.30(REG_OUT/LDO_OUT)
GM1_RSET: R103.2 U13.39(RSET)
GM1_XTAL_IN: C259.2 U13.36(XTAL_IN) X4.1(IN)
GM1_XTAL_OUT: C257.2 U13.37(XTAL_OUT/EXT_CLK) X4.3(OUT)
HBIAS: C237.2 R64.2 ; also on sheet 2
HCEC: D7.1(K) R48.1 U14.E28(HCEC)
HHPD: C189.2 R54.1 U14.D28(HHPD)
HP-DET: CN2.3 ; also on sheet 2
HPOUTFB: C239.1 CN2.6 R66.2 R122.2 ; also on sheet 2
HPOUTL: C243.1 CN2.5 ; also on sheet 2
HPOUTR: C242.1 CN2.2 ; also on sheet 2
HREXT: R59.2 U14.F26(HREXT)
HS-MIC: C239.2 C240.2 CN2.4 R64.1 R65.2
HSCL: R50.1 U14.D26(HSCL)
HSDA: R51.1 U14.E26(HSDA)
HTX0N: D6.2(IN2) D6.9(NC) U14.C27(HTX0N) USB1.9(TMDSData0-)
HTX0P: D6.1(IN1) D6.10(NC) U14.B27(HTX0P) USB1.7(TMDSData0+)
HTX1N: D5.5(IN4) D5.6(NC) U14.B26(HTX1N) USB1.6(TMDSData1-)
HTX1P: D5.4(IN3) D5.7(NC) U14.A26(HTX1P) USB1.4(TMDSData1+)
HTX2N: D5.2(IN2) D5.9(NC) U14.C25(HTX2N) USB1.3(TMDSData2-)
HTX2P: D5.1(IN1) D5.10(NC) U14.B25(HTX2P) USB1.1(TMDSData2+)
HTXCN: D6.5(IN4) D6.6(NC) U14.B28(HTXCN) USB1.12(TMDSClock-)
HTXCP: D6.4(IN3) D6.7(NC) U14.A28(HTXCP) USB1.10(TMDSClock+)
IR-RX: CGQ1.3(VOUT) R124.1 ; also on sheet 5
LCD0-CLK: FPC1.43 ; also on sheet 4
LCD0-D0: FPC1.7 ; also on sheet 4
LCD0-D1: FPC1.8 ; also on sheet 4
LCD0-D2: FPC1.9 ; also on sheet 4
LCD0-D3: FPC1.10 ; also on sheet 4
LCD0-D4: FPC1.11 ; also on sheet 4
LCD0-D5: FPC1.12 ; also on sheet 4
LCD0-D6: FPC1.13 ; also on sheet 4
LCD0-D7: FPC1.14 ; also on sheet 4
LCD0-D8: FPC1.15 ; also on sheet 4
LCD0-D9: FPC1.16 ; also on sheet 4
LCD0-D10: FPC1.17 ; also on sheet 4
LCD0-D11: FPC1.18 ; also on sheet 4
LCD0-D12: FPC1.19 ; also on sheet 4
LCD0-D13: FPC1.20 ; also on sheet 4
LCD0-D14: FPC1.21 ; also on sheet 4
LCD0-D15: FPC1.22 ; also on sheet 4
LCD0-D16: FPC1.23 ; also on sheet 4
LCD0-D17: FPC1.24 ; also on sheet 4
LCD0-D18: FPC1.25 ; also on sheet 4
LCD0-D19: FPC1.26 ; also on sheet 4
LCD0-D20: FPC1.27 ; also on sheet 4
LCD0-D21: FPC1.28 ; also on sheet 4
LCD0-D22: FPC1.29 ; also on sheet 4
LCD0-D23: FPC1.30 ; also on sheet 4
LCD0-DE: FPC1.40 ; also on sheet 4
LCD0-HSYNC: FPC1.42 ; also on sheet 4
LCD0-PWM: FPC1.32 ; also on sheet 4
LCD0-RST: FPC1.33 ; also on sheet 4
LCD0-VSYNC: FPC1.41 ; also on sheet 4
LEDC: LED2.3(DI) ; also on sheet 4
MCSI0-CKN: FPC2.12 ; also on sheet 5
MCSI0-CKP: FPC2.13 ; also on sheet 5
MCSI0-D0N: FPC2.6 ; also on sheet 5
MCSI0-D0P: FPC2.7 ; also on sheet 5
MCSI0-D1N: FPC2.9 ; also on sheet 5
MCSI0-D1P: FPC2.10 ; also on sheet 5
MCSI0-D2N: FPC2.15 ; also on sheet 5
MCSI0-D2P: FPC2.16 ; also on sheet 5
MCSI0-D3N: FPC2.18 ; also on sheet 5
MCSI0-D3P: FPC2.19 ; also on sheet 5
MCSI0-MCLK: FPC2.24 ; also on sheet 5
MCSI0-PWDN: FPC2.28 ; also on sheet 5
MCSI0-RSTN: FPC2.27 ; also on sheet 5
MCSI0-SCK: FPC2.21 R127.2 ; also on sheet 5
MCSI0-SDA: FPC2.22 R128.2 ; also on sheet 5
MCSI0-USER: FPC2.26 ; also on sheet 5
MICIN3N: C241.1 ; also on sheet 2
MICIN3P: C238.1 ; also on sheet 2
PE0: H1.12 ; also on sheet 4
PE1: H1.21 ; also on sheet 4
PE2: H1.13 ; also on sheet 4
PE3: H1.16 ; also on sheet 4
PE4: H1.15 ; also on sheet 4
PE5: H1.22 ; also on sheet 4
PE6: H1.19 ; also on sheet 4
PE7: H1.24 ; also on sheet 4
PE8: H1.23 ; also on sheet 4
PE9: H1.18 ; also on sheet 4
PE10: H1.27 ; also on sheet 4
PE11: H1.7 ; also on sheet 4
PE12: H1.26 ; also on sheet 4
PE13: H1.11 ; also on sheet 4
PE14: H1.5 ; also on sheet 4
PE15: H1.3 ; also on sheet 4
PHYRSTB0: R90.2 U12.12(PHYRSTB) ; also on sheet 4
PHYRSTB1: R108.2 U13.12(PHYRSTB) ; also on sheet 5
RF: C244.2 R72.1 U9.2(ANT)
RGMII0-CLKIN: U12.35(CLKOUT) ; also on sheet 4
RGMII0-MDC: U12.13(MDC) ; also on sheet 4
RGMII0-MDIO: R83.2 U12.14(MDIO) ; also on sheet 4
RGMII0-RXCK: R93.2 U12.27(PHYAD1/RXC) ; also on sheet 4
RGMII0-RXCTL: R95.2 U12.26(PHYAD2/RXCTL) ; also on sheet 4
RGMII0-RXD0: R89.1 U12.25(RXDLY/RXD0) ; also on sheet 4
RGMII0-RXD1: R86.2 U12.24(TXDLY/RXD1) ; also on sheet 4
RGMII0-RXD2: R82.2 U12.23(PLLOFF/RXD2) ; also on sheet 4
RGMII0-RXD3: R91.1 U12.22(PHYAD0/RXD3) ; also on sheet 4
RGMII0-TXCK: U12.20(TXC) ; also on sheet 4
RGMII0-TXCTL: U12.19(TXCTL) ; also on sheet 4
RGMII0-TXD0: U12.18(TXD0) ; also on sheet 4
RGMII0-TXD1: U12.17(TXD1) ; also on sheet 4
RGMII0-TXD2: U12.16(TXD2) ; also on sheet 4
RGMII0-TXD3: U12.15(TXD3) ; also on sheet 4
RGMII1-CLKIN: U13.35(CLKOUT) ; also on sheet 5
RGMII1-MDC: U13.13(MDC) ; also on sheet 5
RGMII1-MDIO: R101.2 U13.14(MDIO) ; also on sheet 5
RGMII1-RXCK: R111.2 U13.27(PHYAD1/RXC) ; also on sheet 5
RGMII1-RXCTL: R113.2 U13.26(PHYAD2/RXCTL) ; also on sheet 5
RGMII1-RXD0: R107.1 U13.25(RXDLY/RXD0) ; also on sheet 5
RGMII1-RXD1: R104.2 U13.24(TXDLY/RXD1) ; also on sheet 5
RGMII1-RXD2: R100.2 U13.23(PLLOFF/RXD2) ; also on sheet 5
RGMII1-RXD3: R109.1 U13.22(PHYAD0/RXD3) ; also on sheet 5
RGMII1-TXCK: U13.20(TXC) ; also on sheet 5
RGMII1-TXCTL: U13.19(TXCTL) ; also on sheet 5
RGMII1-TXD0: U13.18(TXD0) ; also on sheet 5
RGMII1-TXD1: U13.17(TXD1) ; also on sheet 5
RGMII1-TXD2: U13.16(TXD2) ; also on sheet 5
RGMII1-TXD3: U13.15(TXD3) ; also on sheet 5
SDC0-CLK: D19.2 SIM1.5(CLK) ; also on sheet 4
SDC0-CMD: D21.2 SIM1.3(CMD) ; also on sheet 4
SDC0-D0: D18.1 SIM1.7(DAT0) ; also on sheet 4
SDC0-D1: D17.2 SIM1.8(DAT1) ; also on sheet 4
SDC0-D2: D23.2 SIM1.1(DAT2) ; also on sheet 4
SDC0-D3: D22.1 SIM1.2(CD/DAT3) ; also on sheet 4
SDC0-DET: R63.1 ; also on sheet 4
SDC1-CLK: U9.17(SDIO-DATA-CLK) ; also on sheet 4
SDC1-CMD: U9.16(SDIO-DATA-CMD) ; also on sheet 4
SDC1-D0: U9.18(SDIO-DATA-DATA0) ; also on sheet 4
SDC1-D1: U9.19(SDIO-DATA-DATA1) ; also on sheet 4
SDC1-D2: U9.14(SDIO-DATA2) ; also on sheet 4
SDC1-D3: U9.15(SDIO-DATA3) ; also on sheet 4
SDC2-CLK: U8.M6(CLK) ; also on sheet 4
SDC2-CMD: U8.M5(CMD) ; also on sheet 4
SDC2-D0: U8.A3(DAT0) ; also on sheet 4
SDC2-D1: U8.A4(DAT1) ; also on sheet 4
SDC2-D2: U8.A5(DAT2) ; also on sheet 4
SDC2-D3: U8.B2(DAT3) ; also on sheet 4
SDC2-D4: U8.B3(DAT4) ; also on sheet 4
SDC2-D5: U8.B4(DAT5) ; also on sheet 4
SDC2-D6: U8.B5(DAT6) ; also on sheet 4
SDC2-D7: U8.B6(DAT7) ; also on sheet 4
SDC2-DS: U8.H5(DS) ; also on sheet 4
SDC2-RST: U8.K5(RST_n) ; also on sheet 4
SPI0-CLK: U18.6(CLK) ; also on sheet 5
SPI0-CS: R73.1 U18.1(#CS) ; also on sheet 5
SPI0-HOLD: R75.1 U18.7(#HOLD/IO3) ; also on sheet 5
SPI0-MISO: U18.2(DO/IO1) ; also on sheet 5
SPI0-MOSI: U18.5(DI/IO0) ; also on sheet 5
SPI0-WP: R74.1 U18.3(#WP/IO2) ; also on sheet 5
SPI-LCD-BLK: H1.32 R119.2 U16.4(EN) ; also on sheet 5
SPI-LCD-CLK: H1.36 TFT1.4(SCLK) ; also on sheet 5
SPI-LCD-CS: H1.33 TFT1.7(CS) ; also on sheet 5
SPI-LCD-DC: H1.38 TFT1.5(RS) ; also on sheet 5
SPI-LCD-MOSI: H1.35 TFT1.3(SDIN) ; also on sheet 5
SPI-LCD-RST: H1.31 TFT1.6(RES) ; also on sheet 5
STWI1-SCK: H1.28 ; also on sheet 5
STWI1-SDA: H1.29 ; also on sheet 5
UART1-CTS: U9.41(UART-RTS-N) ; also on sheet 4
UART1-RTS: U9.44(UART-CTS-N) ; also on sheet 4
UART1-RX: U9.42(UART-TXD) ; also on sheet 4
UART1-TX: U9.43(UART-RXD) ; also on sheet 4
USB0-DM: D26.2 U14.B24(USB0-DM) USB3.A7(DN1) USB3.B7(DN2)
USB0-DP: D25.2 U14.A24(USB0-DP) USB3.A6(DP1) USB3.B6(DP2)
USB0-DRVVBUS: R118.2 U17.4(EN) ; also on sheet 5
USB0-VBUSDET: R120.1 R121.2 ; also on sheet 5
USB1-DM: D13.4(IN3) D13.7(NC) U14.E24(USB1-DM) USB2.2(D1-)
USB1-DP: D13.5(IN4) D13.6(NC) U14.D24(USB1-DP) USB2.3(D1+)
USB2-DM: D14.4(IN3) D14.7(NC) U14.E22(USB2-DM) USB2.11(D2-)
USB2-DP: D14.5(IN4) D14.6(NC) U14.D22(USB2-DP) USB2.12(D2+)
USB2-RXN: D15.1(IN1) D15.10(NC) U14.C23(PCIE-RX0-DN/USB3-RXN) USB2.14(StdA_SSRX2-)
USB2-RXP: D15.2(IN2) D15.9(NC) U14.B23(PCIE-RX0-DP/USB3-RXP) USB2.15(StdA_SSRX2+)
USB2-TXN: C219.1 U14.B22(PCIE-TX0-DN/USB3-TXN)
USB2-TXP: C220.1 U14.A22(PCIE-TX0-DP/USB3-TXP)
WL-REG-ON: U9.12(WL-REG-ON) ; also on sheet 4
WL-WAKE-AP: U9.13(WL-HOST-WAKE) ; also on sheet 4
$6N1044: R44.2 U14.G22(USB0-REXT)
$6N1104: R46.2 U14.G24(USB1-REXT)
$6N1424: R55.2 U14.F28(EDP-REXT)
$6N1887: R45.1 U14.G20(USB2-REXT)
$6N1980: R49.2 U14.E20(PCIE-REXT)
$6N3848: D7.2(A) R47.2
$6N3980: D8.1(IN1) D8.10(NC) R48.2 USB1.13(CEC)
$6N4130: D9.1(K) USB1.18(+5VPower)
$6N4341: D8.2(IN2) D8.9(NC) R50.2 R52.2 USB1.15(SCL)
$6N4352: D8.4(IN3) D8.7(NC) R51.2 R53.2 USB1.16(SDA)
$6N4414: D8.5(IN4) D8.6(NC) R54.2 USB1.19(HotPlugDetect)
$6N5317: C190.2 D10.1(IN1) D10.10(NC) U15.1(ML0_P)
$6N5400: C191.2 D10.2(IN2) D10.9(NC) U15.3(ML0_N)
$6N5519: C192.2 D10.4(IN3) D10.7(NC) U15.4(ML1_P)
$6N5561: C193.2 D10.5(IN4) D10.6(NC) U15.6(ML1_N)
$6N5603: C194.2 D11.1(IN1) D11.10(NC) U15.7(ML2_P)
$6N5645: C195.2 D11.2(IN2) D11.9(NC) U15.9(ML2_N)
$6N5687: C196.2 D11.4(IN3) D11.7(NC) U15.10(ML3_P)
$6N5729: C197.2 D11.5(IN4) D11.6(NC) U15.12(ML3_N)
$6N6451: C199.2 D12.2(IN2) D12.9(NC) R61.2 U15.17(AUX_N)
$6N6466: C198.2 D12.1(IN1) D12.10(NC) R62.2 U15.15(AUX_P)
$6N6553: R57.2 U15.14(CONFIG2)
$6N6556: R56.2 U15.13(CONFIG1)
$6N19248: C220.2 D15.5(IN4) D15.6(NC) USB2.18(StdA_SSTX2+)
$6N19249: C219.2 D15.4(IN3) D15.7(NC) USB2.17(StdA_SSTX2-)
$6N30377: R117.1 U17.3(ISET)
$6N60371: D32.2(A) R120.2 U17.1(OUT)
$8N2040: D16.1 R63.2 SIM1.11(DET)
$8N6741: LED2.1(DO) LED3.3(DI)
$8N6795: LED3.1(DO) LED4.3(DI)
$8N6805: LED4.1(DO) LED5.3(DI)
$8N9148: R115.2 R116.1 U16.3(ISET)
$8N11462: R126.1 TFT1.12(LED+)
$10N1043: C248.2 RJ1.P1
$10N3488: R79.2 RJ1.12
$10N3497: R80.1 RJ1.13
$11N1789: C255.2 RJ2.P1
$11N1876: R97.2 RJ2.12
$11N1882: R98.1 RJ2.13
$12N612: D2.2 DC1.1 Q1.3(D)
$12N673: Q1.1(G) R1.1 R2.2
$12N750: C3.2 DC1.5
$12N1163: C4.1 U3.1(BOOT)
$12N1491: C8.2 U3.4(SS)
$12N1559: C4.2 D4.2(K) L1.1 U3.8(PH)
$12N1618: C9.1 C10.1 U3.6(COMP)
$12N1697: C9.2 R7.1
$12N1966: R3.1 R5.2
$12N2016: R5.1 R8.2 U3.5(VSENSE)
$12N2052: R4.1 R6.2 U3.3(EN)
$12N3300: CN4.2 D1.1(K)
$13N975: C245.2 R72.2 RF1.1(SIG)
$13N1231: R76.1 U11.8(S)
$13N1378: R77.1 R78.1
$13N1478: CN3.1 R77.2 U11.7(CANH)
$13N1485: CN3.2 R78.2 U11.6(CANL)
$13N1600: C238.2 R65.1
$13N1603: C241.2 R66.1
$13N2020: C242.2 R67.2
$13N2077: C243.2 R68.2
$13N5258: CGQ1.4(VCC) R125.1

Not connected (* = marked no-connect by the designer): D12 5(IN4)* 6(NC)*; D13 1(IN1)* 2(IN2)* 9(NC)* 10(NC)*; D14 1(IN1)* 2(IN2)* 9(NC)* 10(NC)*; DC1 4*; FPC1 34* 45* 46* 47* 48* 49*; FPC2 1*; LED5 1(DO)*; TFT1 1(TP0)* 2(TP1)* 9(NC)*; U8 G3(RFU)*; U9 4(NC1)* 5(NC2)* 8(NC3)* 10(NC4)* 11(NC5)* 21(NC6)* 23(NC7)* 24(LPO)* 25(PCM-OUT)* 26(PCM-CLK)* 27(PCM-IN)* 28(PCM-SYNC)* 29(NC8)* 30(TCXO-IN)* 32(NC9)* 35(NC10)* 37(NC11)* 38(NC12)* 39(NC13)* 40(NC14)*; U14 F20(PCIE-TEST)*; USB2 5(StdA_SSRX1-)* 6(StdA_SSRX1+)* 8(StdA_SSTX1-)* 9(StdA_SSTX1+)*

## Notes on the sheets
sheet 6
- OTG 复用 SBU 作为 UART 调试串口
sheet 7
- Card
- GPHY
- USB30
- CAM
- HDMI
- GPIO
- DP
- MIPI
- GPHY
- GPIO
- WIFI
- eMMC
- GPIO
- LPDDR4
- AUDIO
- DEBUG
- GPIO
- LCD
- OSC
sheet 9
- Enable/Disable PLL @ ALDPS
- RGMII TXC/RXC Delay Config.
- RGMII Voltage Config.
- PHY Address Config.
sheet 10
- Enable/Disable PLL @ ALDPS
- RGMII TXC/RXC Delay Config.
- RGMII Voltage Config.
- PHY Address Config.
